# EAGLE design 2_10decoder (EAGLE 8.7.0)
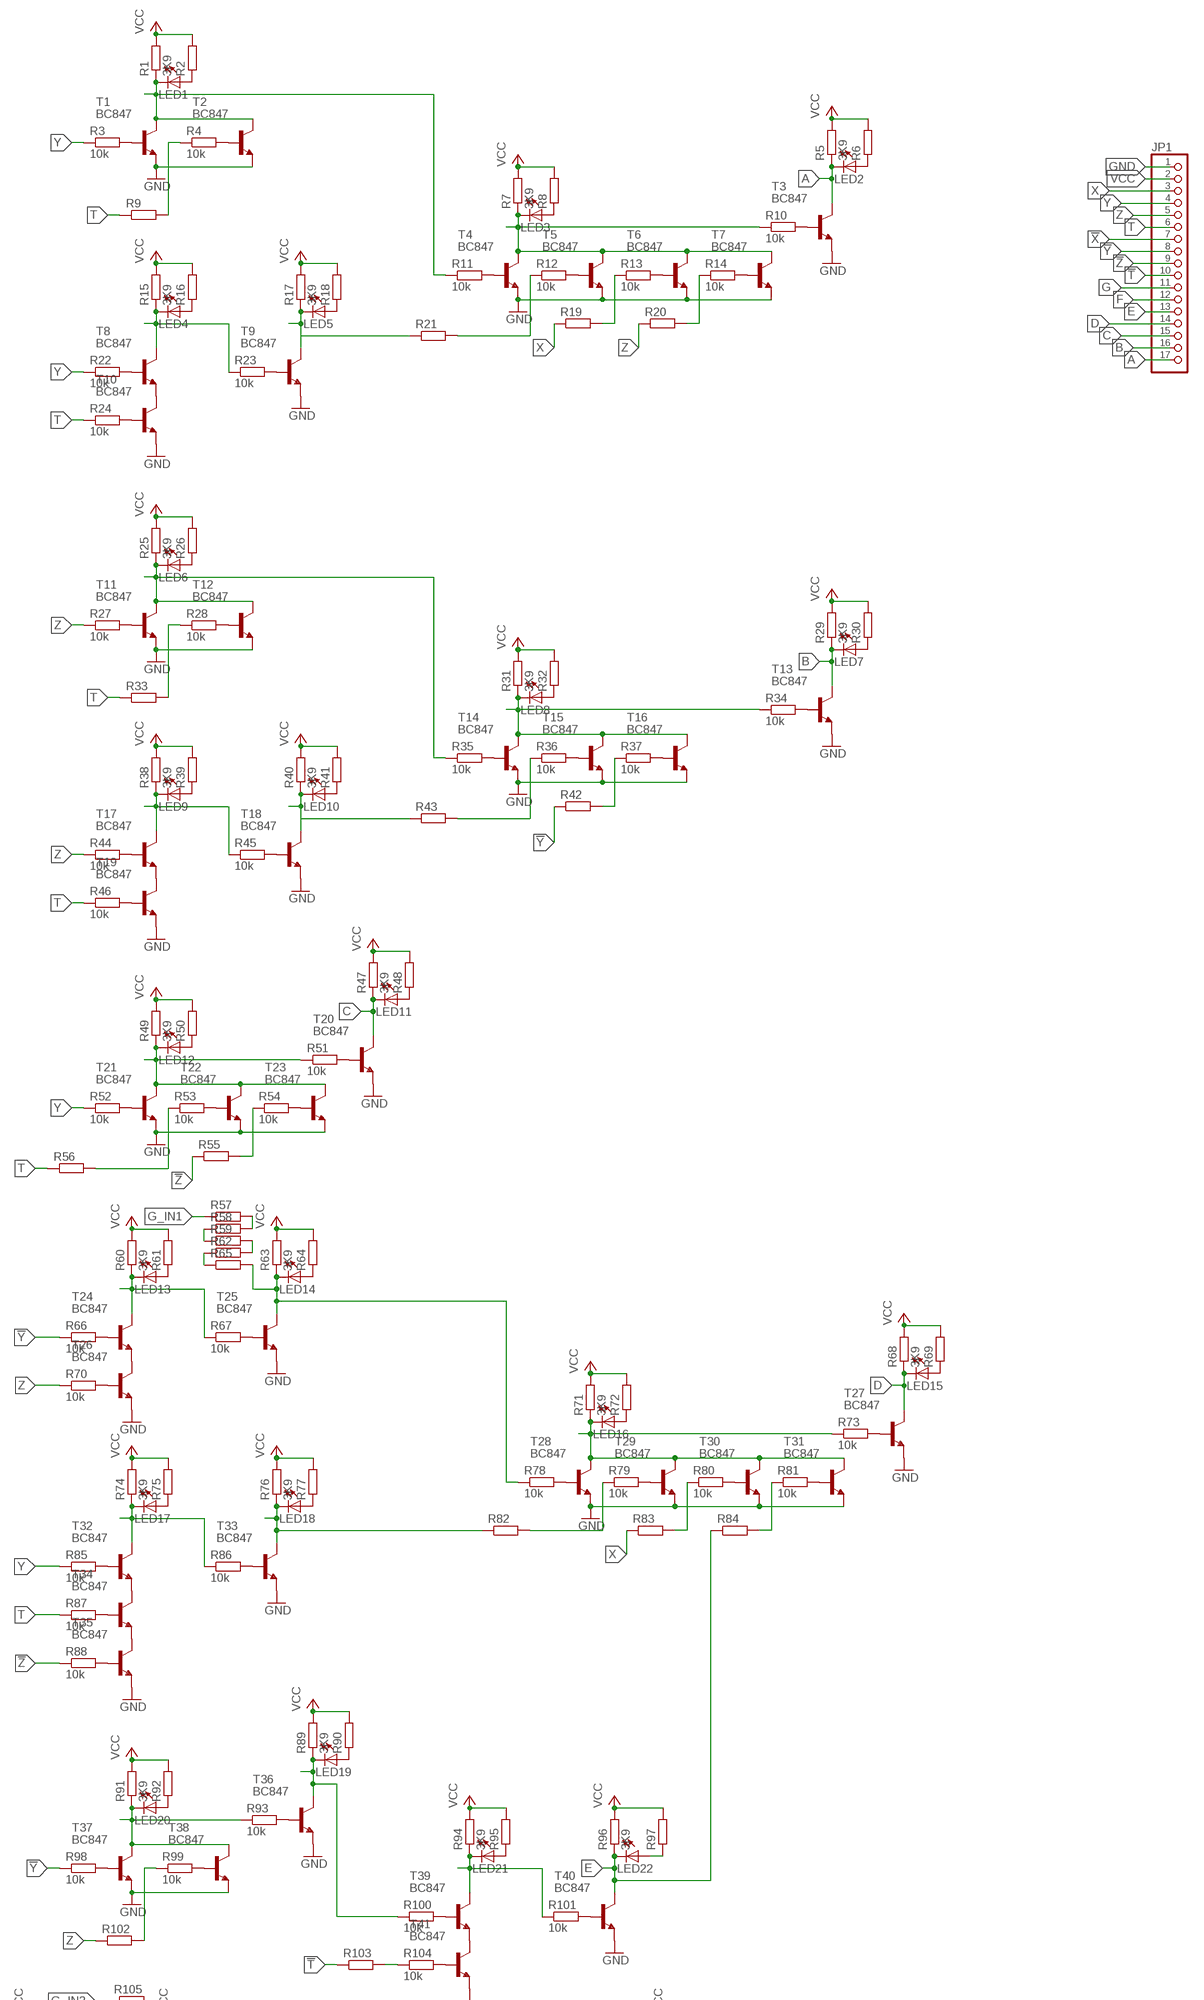
[diagram p0: schematic, sheet 1, part 1 of 2]
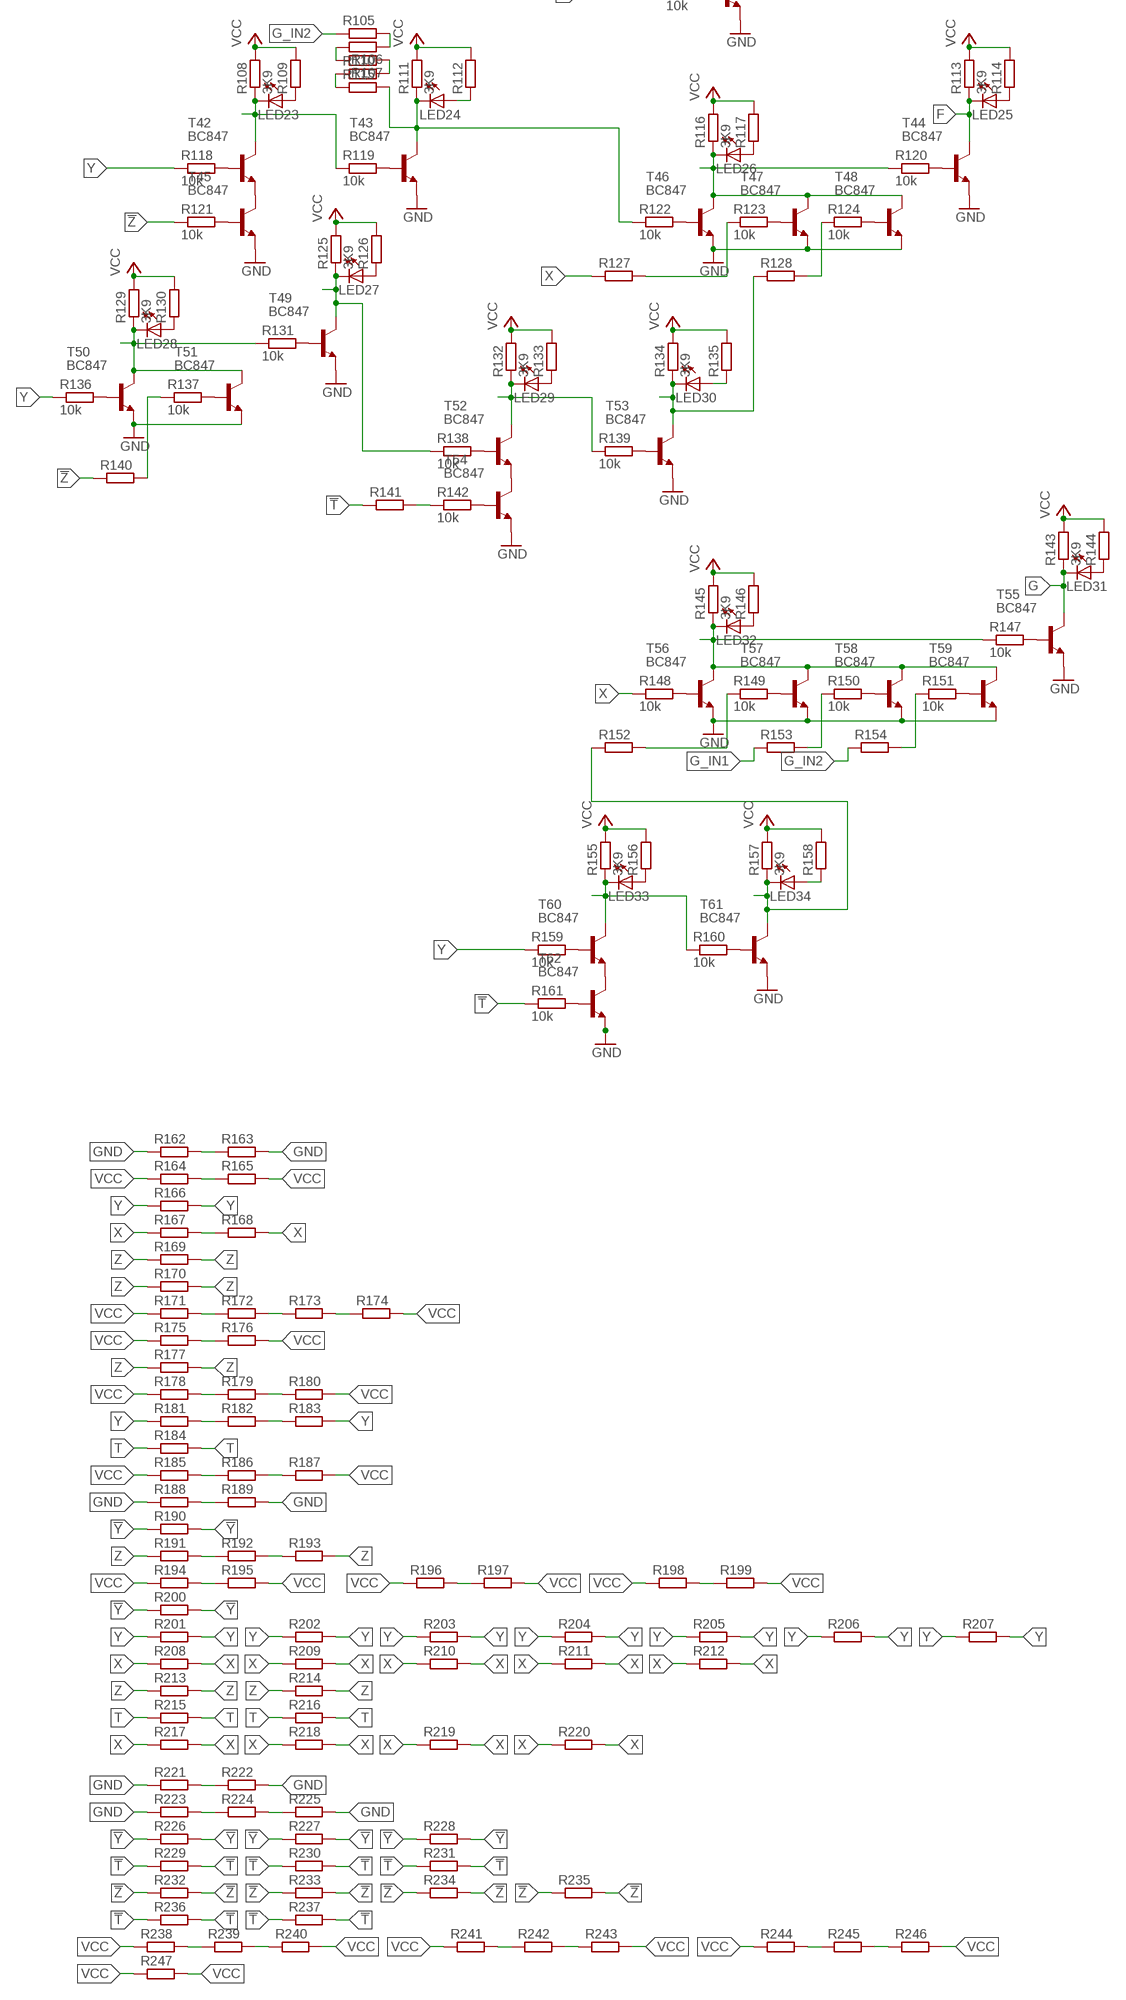
[diagram p1: schematic, sheet 1, part 2 of 2]

## Parts
JP1  PINHD-1X17_2.54-SMD-90°  [1X17SMD/90]
LED1  LEDCHIP-LED0805  [CHIP-LED0805]
LED2  LEDCHIP-LED0805  [CHIP-LED0805]
LED3  LEDCHIP-LED0805  [CHIP-LED0805]
LED4  LEDCHIP-LED0805  [CHIP-LED0805]
LED5  LEDCHIP-LED0805  [CHIP-LED0805]
LED6  LEDCHIP-LED0805  [CHIP-LED0805]
LED7  LEDCHIP-LED0805  [CHIP-LED0805]
LED8  LEDCHIP-LED0805  [CHIP-LED0805]
LED9  LEDCHIP-LED0805  [CHIP-LED0805]
LED10  LEDCHIP-LED0805  [CHIP-LED0805]
LED11  LEDCHIP-LED0805  [CHIP-LED0805]
LED12  LEDCHIP-LED0805  [CHIP-LED0805]
LED13  LEDCHIP-LED0805  [CHIP-LED0805]
LED14  LEDCHIP-LED0805  [CHIP-LED0805]
LED15  LEDCHIP-LED0805  [CHIP-LED0805]
LED16  LEDCHIP-LED0805  [CHIP-LED0805]
LED17  LEDCHIP-LED0805  [CHIP-LED0805]
LED18  LEDCHIP-LED0805  [CHIP-LED0805]
LED19  LEDCHIP-LED0805  [CHIP-LED0805]
LED20  LEDCHIP-LED0805  [CHIP-LED0805]
LED21  LEDCHIP-LED0805  [CHIP-LED0805]
LED22  LEDCHIP-LED0805  [CHIP-LED0805]
LED23  LEDCHIP-LED0805  [CHIP-LED0805]
LED24  LEDCHIP-LED0805  [CHIP-LED0805]
LED25  LEDCHIP-LED0805  [CHIP-LED0805]
LED26  LEDCHIP-LED0805  [CHIP-LED0805]
LED27  LEDCHIP-LED0805  [CHIP-LED0805]
LED28  LEDCHIP-LED0805  [CHIP-LED0805]
LED29  LEDCHIP-LED0805  [CHIP-LED0805]
LED30  LEDCHIP-LED0805  [CHIP-LED0805]
LED31  LEDCHIP-LED0805  [CHIP-LED0805]
LED32  LEDCHIP-LED0805  [CHIP-LED0805]
LED33  LEDCHIP-LED0805  [CHIP-LED0805]
LED34  LEDCHIP-LED0805  [CHIP-LED0805]
R1  3K9  R-EU_M0805  [M0805]
R2  R-EU_M0805  [M0805]
R3  10k  R-EU_M0805  [M0805]
R4  10k  R-EU_M0805  [M0805]
R5  3K9  R-EU_M0805  [M0805]
R6  R-EU_M0805  [M0805]
R7  3K9  R-EU_M0805  [M0805]
R8  R-EU_M0805  [M0805]
R9  R-EU_M1206  [M1206]
R10  10k  R-EU_M0805  [M0805]
R11  10k  R-EU_M0805  [M0805]
R12  10k  R-EU_M0805  [M0805]
R13  10k  R-EU_M0805  [M0805]
R14  10k  R-EU_M0805  [M0805]
R15  3K9  R-EU_M0805  [M0805]
R16  R-EU_M0805  [M0805]
R17  3K9  R-EU_M0805  [M0805]
R18  R-EU_M0805  [M0805]
R19  R-EU_M1206  [M1206]
R20  R-EU_M1206  [M1206]
R21  R-EU_M1206  [M1206]
R22  10k  R-EU_M0805  [M0805]
R23  10k  R-EU_M0805  [M0805]
R24  10k  R-EU_M0805  [M0805]
R25  3K9  R-EU_M0805  [M0805]
R26  R-EU_M0805  [M0805]
R27  10k  R-EU_M0805  [M0805]
R28  10k  R-EU_M0805  [M0805]
R29  3K9  R-EU_M0805  [M0805]
R30  R-EU_M0805  [M0805]
R31  3K9  R-EU_M0805  [M0805]
R32  R-EU_M0805  [M0805]
R33  R-EU_M1206  [M1206]
R34  10k  R-EU_M0805  [M0805]
R35  10k  R-EU_M0805  [M0805]
R36  10k  R-EU_M0805  [M0805]
R37  10k  R-EU_M0805  [M0805]
R38  3K9  R-EU_M0805  [M0805]
R39  R-EU_M0805  [M0805]
R40  3K9  R-EU_M0805  [M0805]
R41  R-EU_M0805  [M0805]
R42  R-EU_M1206  [M1206]
R43  R-EU_M1206  [M1206]
R44  10k  R-EU_M0805  [M0805]
R45  10k  R-EU_M0805  [M0805]
R46  10k  R-EU_M0805  [M0805]
R47  3K9  R-EU_M0805  [M0805]
R48  R-EU_M0805  [M0805]
R49  3K9  R-EU_M0805  [M0805]
R50  R-EU_M0805  [M0805]
R51  10k  R-EU_M0805  [M0805]
R52  10k  R-EU_M0805  [M0805]
R53  10k  R-EU_M0805  [M0805]
R54  10k  R-EU_M0805  [M0805]
R55  R-EU_M1206  [M1206]
R56  R-EU_M1206  [M1206]
R57  R-EU_M1206  [M1206]
R58  R-EU_M1206  [M1206]
R59  R-EU_M1206  [M1206]
R60  3K9  R-EU_M0805  [M0805]
R61  R-EU_M0805  [M0805]
R62  R-EU_M1206  [M1206]
R63  3K9  R-EU_M0805  [M0805]
R64  R-EU_M0805  [M0805]
R65  R-EU_M1206  [M1206]
R66  10k  R-EU_M0805  [M0805]
R67  10k  R-EU_M0805  [M0805]
R68  3K9  R-EU_M0805  [M0805]
R69  R-EU_M0805  [M0805]
R70  10k  R-EU_M0805  [M0805]
R71  3K9  R-EU_M0805  [M0805]
R72  R-EU_M0805  [M0805]
R73  10k  R-EU_M0805  [M0805]
R74  3K9  R-EU_M0805  [M0805]
R75  R-EU_M0805  [M0805]
R76  3K9  R-EU_M0805  [M0805]
R77  R-EU_M0805  [M0805]
R78  10k  R-EU_M0805  [M0805]
R79  10k  R-EU_M0805  [M0805]
R80  10k  R-EU_M0805  [M0805]
R81  10k  R-EU_M0805  [M0805]
R82  R-EU_M1206  [M1206]
R83  R-EU_M1206  [M1206]
R84  R-EU_M1206  [M1206]
R85  10k  R-EU_M0805  [M0805]
R86  10k  R-EU_M0805  [M0805]
R87  10k  R-EU_M0805  [M0805]
R88  10k  R-EU_M0805  [M0805]
R89  3K9  R-EU_M0805  [M0805]
R90  R-EU_M0805  [M0805]
R91  3K9  R-EU_M0805  [M0805]
R92  R-EU_M0805  [M0805]
R93  10k  R-EU_M0805  [M0805]
R94  3K9  R-EU_M0805  [M0805]
R95  R-EU_M0805  [M0805]
R96  3K9  R-EU_M0805  [M0805]
R97  R-EU_M0805  [M0805]
R98  10k  R-EU_M0805  [M0805]
R99  10k  R-EU_M0805  [M0805]
R100  10k  R-EU_M0805  [M0805]
R101  10k  R-EU_M0805  [M0805]
R102  R-EU_M1206  [M1206]
R103  R-EU_M1206  [M1206]
R104  10k  R-EU_M0805  [M0805]
R105  R-EU_M1206  [M1206]
R106  R-EU_M1206  [M1206]
R107  R-EU_M1206  [M1206]
R108  3K9  R-EU_M0805  [M0805]
R109  R-EU_M0805  [M0805]
R110  R-EU_M1206  [M1206]
R111  3K9  R-EU_M0805  [M0805]
R112  R-EU_M0805  [M0805]
R113  3K9  R-EU_M0805  [M0805]
R114  R-EU_M0805  [M0805]
R115  R-EU_M1206  [M1206]
R116  3K9  R-EU_M0805  [M0805]
R117  R-EU_M0805  [M0805]
R118  10k  R-EU_M0805  [M0805]
R119  10k  R-EU_M0805  [M0805]
R120  10k  R-EU_M0805  [M0805]
R121  10k  R-EU_M0805  [M0805]
R122  10k  R-EU_M0805  [M0805]
R123  10k  R-EU_M0805  [M0805]
R124  10k  R-EU_M0805  [M0805]
R125  3K9  R-EU_M0805  [M0805]
R126  R-EU_M0805  [M0805]
R127  R-EU_M1206  [M1206]
R128  R-EU_M1206  [M1206]
R129  3K9  R-EU_M0805  [M0805]
R130  R-EU_M0805  [M0805]
R131  10k  R-EU_M0805  [M0805]
R132  3K9  R-EU_M0805  [M0805]
R133  R-EU_M0805  [M0805]
R134  3K9  R-EU_M0805  [M0805]
R135  R-EU_M0805  [M0805]
R136  10k  R-EU_M0805  [M0805]
R137  10k  R-EU_M0805  [M0805]
R138  10k  R-EU_M0805  [M0805]
R139  10k  R-EU_M0805  [M0805]
R140  R-EU_M1206  [M1206]
R141  R-EU_M1206  [M1206]
R142  10k  R-EU_M0805  [M0805]
R143  3K9  R-EU_M0805  [M0805]
R144  R-EU_M0805  [M0805]
R145  3K9  R-EU_M0805  [M0805]
R146  R-EU_M0805  [M0805]
R147  10k  R-EU_M0805  [M0805]
R148  10k  R-EU_M0805  [M0805]
R149  10k  R-EU_M0805  [M0805]
R150  10k  R-EU_M0805  [M0805]
R151  10k  R-EU_M0805  [M0805]
R152  R-EU_M1206  [M1206]
R153  R-EU_M1206  [M1206]
R154  R-EU_M1206  [M1206]
R155  3K9  R-EU_M0805  [M0805]
R156  R-EU_M0805  [M0805]
R157  3K9  R-EU_M0805  [M0805]
R158  R-EU_M0805  [M0805]
R159  10k  R-EU_M0805  [M0805]
R160  10k  R-EU_M0805  [M0805]
R161  10k  R-EU_M0805  [M0805]
R162  R-EU_M1206  [M1206]
R163  R-EU_M1206  [M1206]
R164  R-EU_M1206  [M1206]
R165  R-EU_M1206  [M1206]
R166  R-EU_M1206  [M1206]
R167  R-EU_M1206  [M1206]
R168  R-EU_M1206  [M1206]
R169  R-EU_M1206  [M1206]
R170  R-EU_M1206  [M1206]
R171  R-EU_M1206  [M1206]
R172  R-EU_M1206  [M1206]
R173  R-EU_M1206  [M1206]
R174  R-EU_M1206  [M1206]
R175  R-EU_M1206  [M1206]
R176  R-EU_M1206  [M1206]
R177  R-EU_M1206  [M1206]
R178  R-EU_M1206  [M1206]
R179  R-EU_M1206  [M1206]
R180  R-EU_M1206  [M1206]
R181  R-EU_M1206  [M1206]
R182  R-EU_M1206  [M1206]
R183  R-EU_M1206  [M1206]
R184  R-EU_M1206  [M1206]
R185  R-EU_M1206  [M1206]
R186  R-EU_M1206  [M1206]
R187  R-EU_M1206  [M1206]
R188  R-EU_M1206  [M1206]
R189  R-EU_M1206  [M1206]
R190  R-EU_M1206  [M1206]
R191  R-EU_M1206  [M1206]
R192  R-EU_M1206  [M1206]
R193  R-EU_M1206  [M1206]
R194  R-EU_M1206  [M1206]
R195  R-EU_M1206  [M1206]
R196  R-EU_M1206  [M1206]
R197  R-EU_M1206  [M1206]
R198  R-EU_M1206  [M1206]
R199  R-EU_M1206  [M1206]
R200  R-EU_M1206  [M1206]
R201  R-EU_M1206  [M1206]
R202  R-EU_M1206  [M1206]
R203  R-EU_M1206  [M1206]
R204  R-EU_M1206  [M1206]
R205  R-EU_M1206  [M1206]
R206  R-EU_M1206  [M1206]
R207  R-EU_M1206  [M1206]
R208  R-EU_M1206  [M1206]
R209  R-EU_M1206  [M1206]
R210  R-EU_M1206  [M1206]
R211  R-EU_M1206  [M1206]
R212  R-EU_M1206  [M1206]
R213  R-EU_M1206  [M1206]
R214  R-EU_M1206  [M1206]
R215  R-EU_M1206  [M1206]
R216  R-EU_M1206  [M1206]
R217  R-EU_M1206  [M1206]
R218  R-EU_M1206  [M1206]
R219  R-EU_M1206  [M1206]
R220  R-EU_M1206  [M1206]
R221  R-EU_M1206  [M1206]
R222  R-EU_M1206  [M1206]
R223  R-EU_M1206  [M1206]
R224  R-EU_M1206  [M1206]
R225  R-EU_M1206  [M1206]
R226  R-EU_M1206  [M1206]
R227  R-EU_M1206  [M1206]
R228  R-EU_M1206  [M1206]
R229  R-EU_M1206  [M1206]
R230  R-EU_M1206  [M1206]
R231  R-EU_M1206  [M1206]
R232  R-EU_M1206  [M1206]
R233  R-EU_M1206  [M1206]
R234  R-EU_M1206  [M1206]
R235  R-EU_M1206  [M1206]
R236  R-EU_M1206  [M1206]
R237  R-EU_M1206  [M1206]
R238  R-EU_M1206  [M1206]
R239  R-EU_M1206  [M1206]
R240  R-EU_M1206  [M1206]
R241  R-EU_M1206  [M1206]
R242  R-EU_M1206  [M1206]
R243  R-EU_M1206  [M1206]
R244  R-EU_M1206  [M1206]
R245  R-EU_M1206  [M1206]
R246  R-EU_M1206  [M1206]
R247  R-EU_M1206  [M1206]
T1  BC847  [SOT23]
T2  BC847  [SOT23]
T3  BC847  [SOT23]
T4  BC847  [SOT23]
T5  BC847  [SOT23]
T6  BC847  [SOT23]
T7  BC847  [SOT23]
T8  BC847  [SOT23]
T9  BC847  [SOT23]
T10  BC847  [SOT23]
T11  BC847  [SOT23]
T12  BC847  [SOT23]
T13  BC847  [SOT23]
T14  BC847  [SOT23]
T15  BC847  [SOT23]
T16  BC847  [SOT23]
T17  BC847  [SOT23]
T18  BC847  [SOT23]
T19  BC847  [SOT23]
T20  BC847  [SOT23]
T21  BC847  [SOT23]
T22  BC847  [SOT23]
T23  BC847  [SOT23]
T24  BC847  [SOT23]
T25  BC847  [SOT23]
T26  BC847  [SOT23]
T27  BC847  [SOT23]
T28  BC847  [SOT23]
T29  BC847  [SOT23]
T30  BC847  [SOT23]
T31  BC847  [SOT23]
T32  BC847  [SOT23]
T33  BC847  [SOT23]
T34  BC847  [SOT23]
T35  BC847  [SOT23]
T36  BC847  [SOT23]
T37  BC847  [SOT23]
T38  BC847  [SOT23]
T39  BC847  [SOT23]
T40  BC847  [SOT23]
T41  BC847  [SOT23]
T42  BC847  [SOT23]
T43  BC847  [SOT23]
T44  BC847  [SOT23]
T45  BC847  [SOT23]
T46  BC847  [SOT23]
T47  BC847  [SOT23]
T48  BC847  [SOT23]
T49  BC847  [SOT23]
T50  BC847  [SOT23]
T51  BC847  [SOT23]
T52  BC847  [SOT23]
T53  BC847  [SOT23]
T54  BC847  [SOT23]
T55  BC847  [SOT23]
T56  BC847  [SOT23]
T57  BC847  [SOT23]
T58  BC847  [SOT23]
T59  BC847  [SOT23]
T60  BC847  [SOT23]
T61  BC847  [SOT23]
T62  BC847  [SOT23]

## Nets
!T: JP1.10 R103.1 R141.1 R161.1 R229.1 R229.2 R230.1 R230.2 R231.1 R231.2 R236.1 R236.2 R237.1 R237.2
!X: JP1.7
!Y: JP1.8 R42.1 R66.1 R98.1 R190.1 R190.2 R200.1 R200.2 R226.1 R226.2 R227.1 R227.2 R228.1 R228.2
!Z: JP1.9 R55.1 R88.1 R121.1 R140.1 R232.1 R232.2 R233.1 R233.2 R234.1 R234.2 R235.1 R235.2
A: JP1.17 LED2.C R5.1 T3.3(C)
B: JP1.16 LED7.C R29.1 T13.3(C)
C: JP1.15 LED11.C R47.1 T20.3(C)
D: JP1.14 LED15.C R68.1 T27.3(C)
E: JP1.13 LED22.C R84.1 R96.1 T40.3(C)
F: JP1.12 LED25.C R113.1 T44.3(C)
G: JP1.11 LED31.C R143.1 T55.3(C)
G_IN1: R57.1 R153.1
G_IN2: R105.1 R154.1
GND: JP1.1 R162.1 R163.2 R188.1 R188.2 R189.1 R189.2 R221.1 R221.2 R222.1 R222.2 R223.1 R223.2 R224.1 R224.2 R225.1 R225.2 T1.2(E) T2.2(E) T3.2(E) T4.2(E) T5.2(E) T6.2(E) T7.2(E) T9.2(E) T10.2(E) T11.2(E) T12.2(E) T13.2(E) T14.2(E) T15.2(E) T16.2(E) T18.2(E) T19.2(E) T20.2(E) T21.2(E) T22.2(E) T23.2(E) T25.2(E) T26.2(E) T27.2(E) T28.2(E) T29.2(E) T30.2(E) T31.2(E) T33.2(E) T35.2(E) T36.2(E) T37.2(E) T38.2(E) T40.2(E) T41.2(E) T43.2(E) T44.2(E) T45.2(E) T46.2(E) T47.2(E) T48.2(E) T49.2(E) T50.2(E) T51.2(E) T53.2(E) T54.2(E) T55.2(E) T56.2(E) T57.2(E) T58.2(E) T59.2(E) T61.2(E) T62.2(E)
N$1: LED4.A R16.1
N$2: LED4.C R15.1 R23.1 T8.3(C)
N$3: R3.2 T1.1(B)
N$4: R4.2 T2.1(B)
N$5: R22.2 T8.1(B)
N$6: R23.2 T9.1(B)
N$7: R24.2 T10.1(B)
N$8: R11.2 T4.1(B)
N$9: R10.2 T3.1(B)
N$10: R12.2 T5.1(B)
N$11: R13.2 T6.1(B)
N$12: R14.2 T7.1(B)
N$13: LED1.A R2.1
N$14: LED1.C R1.1 R11.1 T1.3(C) T2.3(C)
N$15: R4.1 R9.2
N$16: R103.2 R104.1
N$17: LED3.A R8.1
N$18: LED3.C R7.1 R10.1 T4.3(C) T5.3(C) T6.3(C) T7.3(C)
N$19: LED5.A R18.1
N$20: LED5.C R17.1 R21.1 T9.3(C)
N$21: LED2.A R6.1
N$22: R141.2 R142.1
N$23: T8.2(E) T10.3(C)
N$24: R12.1 R21.2
N$25: R106.2 R107.2
N$26: R110.1 R115.1
N$27: R27.2 T11.1(B)
N$28: R28.2 T12.1(B)
N$29: R13.1 R19.2
N$30: R14.1 R20.2
N$31: R44.2 T17.1(B)
N$32: R45.2 T18.1(B)
N$33: R46.2 T19.1(B)
N$34: R35.2 T14.1(B)
N$35: R34.2 T13.1(B)
N$36: R36.2 T15.1(B)
N$37: R37.2 T16.1(B)
N$38: R105.2 R106.1
N$39: LED6.A R26.1
N$40: LED6.C R25.1 R35.1 T11.3(C) T12.3(C)
N$41: R28.1 R33.2
N$42: R107.1 R110.2
N$43: LED9.A R39.1
N$44: LED9.C R38.1 R45.1 T17.3(C)
N$45: LED8.A R32.1
N$46: LED8.C R31.1 R34.1 T14.3(C) T15.3(C) T16.3(C)
N$47: LED10.A R41.1
N$48: LED10.C R40.1 R43.1 T18.3(C)
N$49: LED7.A R30.1
N$50: R62.1 R65.1
N$51: T17.2(E) T19.3(C)
N$52: R59.2 R62.2
N$53: R58.1 R59.1
N$54: R37.1 R42.2
N$55: R57.2 R58.2
N$56: R36.1 R43.2
N$57: R52.2 T21.1(B)
N$58: R51.2 T20.1(B)
N$59: R53.2 T22.1(B)
N$60: R54.2 T23.1(B)
N$61: R78.2 T28.1(B)
N$62: R73.2 T27.1(B)
N$63: LED12.A R50.1
N$64: LED12.C R49.1 R51.1 T21.3(C) T22.3(C) T23.3(C)
N$65: R79.2 T29.1(B)
N$66: LED11.A R48.1
N$67: R162.2 R163.1
N$68: R54.1 R55.2
N$69: R80.2 T30.1(B)
N$70: R53.1 R56.2
N$71: R81.2 T31.1(B)
N$72: R164.2 R165.1
N$73: LED16.A R72.1
N$74: LED16.C R71.1 R73.1 T28.3(C) T29.3(C) T30.3(C) T31.3(C)
N$75: R85.2 T32.1(B)
N$76: LED15.A R69.1
N$77: R167.2 R168.1
N$78: R80.1 R83.2
N$79: R81.1 R84.2
N$80: R79.1 R82.2
N$81: T34.2(E) T35.3(C)
N$82: R67.2 T25.1(B)
N$83: R70.2 T26.1(B)
N$84: LED13.A R61.1
N$85: LED13.C R60.1 R67.1 T24.3(C)
N$86: LED14.A R64.1
N$87: R86.2 T33.1(B)
N$88: T24.2(E) T26.3(C)
N$89: R122.2 T46.1(B)
N$90: R171.2 R172.1
N$91: R87.2 T34.1(B)
N$92: LED17.A R75.1
N$93: R123.2 T47.1(B)
N$94: LED18.A R77.1
N$95: T32.2(E) T34.3(C)
N$96: R159.2 T60.1(B)
N$97: R173.2 R174.1
N$98: LED18.C R76.1 R82.1 T33.3(C)
N$99: R88.2 T35.1(B)
N$100: LED26.A R117.1
N$101: R98.2 T37.1(B)
N$102: R99.2 T38.1(B)
N$103: LED20.A R92.1
N$104: LED20.C R91.1 R93.1 T37.3(C) T38.3(C)
N$105: LED26.C R116.1 R120.1 T46.3(C) T47.3(C) T48.3(C)
N$106: LED25.A R114.1
N$107: R93.2 T36.1(B)
N$108: R100.2 T39.1(B)
N$109: LED19.A R90.1
N$110: R175.2 R176.1
N$111: R101.2 T40.1(B)
N$112: R178.2 R179.1
N$113: R181.2 R182.1
N$114: R124.1 R128.2
N$115: R123.1 R127.2
N$116: R185.2 R186.1
N$117: R191.2 R192.1
N$118: R121.2 T45.1(B)
N$119: LED17.C R74.1 R86.1 T32.3(C)
N$120: R194.2 R195.1
N$121: LED23.A R109.1
N$122: R196.2 R197.1
N$123: R198.2 R199.1
N$124: R238.2 R239.1
N$125: T42.2(E) T45.3(C)
N$126: R241.2 R242.1
N$127: R104.2 T41.1(B)
N$128: R244.2 R245.1
N$129: LED21.C R94.1 R101.1 T39.3(C)
N$132: R136.2 T50.1(B)
N$139: R99.1 R102.2
N$141: R131.2 T49.1(B)
N$143: R138.2 T52.1(B)
N$144: LED19.C R89.1 R100.1 T36.3(C)
N$145: T39.2(E) T41.3(C)
N$147: LED21.A R95.1
N$148: R139.2 T53.1(B)
N$151: LED29.C R132.1 R139.1 T52.3(C)
N$152: T52.2(E) T54.3(C)
N$153: LED27.C R125.1 R138.1 T49.3(C)
N$157: R147.2 T55.1(B)
N$158: R149.2 T57.1(B)
N$159: R150.2 T58.1(B)
N$160: R151.2 T59.1(B)
N$162: R150.1 R153.2
N$164: R149.1 R152.2
N$166: R151.1 R154.2
N$168: R160.2 T61.1(B)
N$169: R161.2 T62.1(B)
N$173: T60.2(E) T62.3(C)
N$200: R66.2 T24.1(B)
N$251: LED28.A R130.1
N$252: LED28.C R129.1 R131.1 T50.3(C) T51.3(C)
N$253: LED27.A R126.1
N$254: LED29.A R133.1
N$255: LED30.C R128.1 R134.1 T53.3(C)
N$256: LED32.A R146.1
N$257: LED32.C R145.1 R147.1 T56.3(C) T57.3(C) T58.3(C) T59.3(C)
N$258: LED31.A R144.1
N$260: LED33.A R156.1
N$261: LED33.C R155.1 R160.1 T60.3(C)
N$262: LED34.C R152.1 R157.1 T61.3(C)
N$263: R120.2 T44.1(B)
N$264: R118.2 T42.1(B)
N$265: R124.2 T48.1(B)
N$266: LED23.C R108.1 R119.1 T42.3(C)
N$267: R119.2 T43.1(B)
N$269: R148.2 T56.1(B)
N$271: R137.1 R140.2
N$272: R137.2 T51.1(B)
N$274: R142.2 T54.1(B)
S$2: LED22.A R97.1
S$4: LED24.A R112.1
S$5: LED34.A R158.1
S$40: LED30.A R135.1
S$123: LED24.C R111.1 R115.2 R122.1 T43.3(C)
S$124: LED14.C R63.1 R65.2 R78.1 T25.3(C)
T: JP1.6 R9.1 R24.1 R33.1 R46.1 R56.1 R87.1 R184.1 R184.2 R215.1 R215.2 R216.1 R216.2
VCC: JP1.2 R1.2 R2.2 R5.2 R6.2 R7.2 R8.2 R15.2 R16.2 R17.2 R18.2 R25.2 R26.2 R29.2 R30.2 R31.2 R32.2 R38.2 R39.2 R40.2 R41.2 R47.2 R48.2 R49.2 R50.2 R60.2 R61.2 R63.2 R64.2 R68.2 R69.2 R71.2 R72.2 R74.2 R75.2 R76.2 R77.2 R89.2 R90.2 R91.2 R92.2 R94.2 R95.2 R96.2 R97.2 R108.2 R109.2 R111.2 R112.2 R113.2 R114.2 R116.2 R117.2 R125.2 R126.2 R129.2 R130.2 R132.2 R133.2 R134.2 R135.2 R143.2 R144.2 R145.2 R146.2 R155.2 R156.2 R157.2 R158.2 R164.1 R165.2 R171.1 R172.2 R173.1 R174.2 R175.1 R176.2 R178.1 R179.2 R180.1 R180.2 R182.2 R183.1 R185.1 R186.2 R187.1 R187.2 R194.1 R195.2 R196.1 R197.2 R198.1 R199.2 R238.1 R239.2 R240.1 R240.2 R241.1 R242.2 R243.1 R243.2 R244.1 R245.2 R246.1 R246.2 R247.1 R247.2
X: JP1.3 R19.1 R83.1 R127.1 R148.1 R167.1 R168.2 R208.1 R208.2 R209.1 R209.2 R210.1 R210.2 R211.1 R211.2 R212.1 R212.2 R217.1 R217.2 R218.1 R218.2 R219.1 R219.2 R220.1 R220.2
Y: JP1.4 R3.1 R22.1 R52.1 R85.1 R118.1 R136.1 R159.1 R166.1 R166.2 R181.1 R183.2 R201.1 R201.2 R202.1 R202.2 R203.1 R203.2 R204.1 R204.2 R205.1 R205.2 R206.1 R206.2 R207.1 R207.2
Z: JP1.5 R20.1 R27.1 R44.1 R70.1 R102.1 R169.1 R169.2 R170.1 R170.2 R177.1 R177.2 R191.1 R192.2 R193.1 R193.2 R213.1 R213.2 R214.1 R214.2

## Library data of the parts
JP1 = pinhead-2:PINHD-1X17: PIN HEADER
LED1-LED34 = led:LED: LED OSRAM: - CHIPLED LG R971, LG N971, LY N971, LG Q971, LY Q971, LO R971, LY R971 LH N974, LH R974 LS Q976, LO Q976, LY Q976 LO Q996 - Hyper CHIPLED LW Q18S LB Q993, LB Q99A, LB R99A - SideLED LS A670, LO A670, LY A670, LG A670, LP A670 LB A673, LV A673, LT A673, LW A673 LH A674 LY A675 LS A676, LA A676, LO A676, LY A676, LW A676 LS A679, LY A679, LG A679 - Hyper Micro SIDELED® LS Y876, LA Y876, LO Y876, LY Y876 LT Y87S - SmartLED LW L88C, LW L88S LB L89C, LB L89S, LG L890 LS L89K, LO L89K, LY L89K LS L896, LA L896, LO L896, LY L896 - TOPLED LS T670, LO T670, LY T670, LG T670, LP T670 LSG T670, LSP T670, LSY T670, LOP T670, LYG T670 LG T671, LOG T671, LSG T671 LB T673, LV T673, LT T673, LW T673 LH T674 LS T676, LA T676, LO T676, LY T676, LB T676, LH T676, LSB T676, LW T676 LB T67C, LV T67C, LT T67C, LS T67K, LO T67K, LY T67K, LW E67C LS E67B, LA E67B, LO E67B, LY E67B, LB E67C, LV E67C, LT E67C LW T67C LS T679, LY T679, LG T679 LS T770, LO T770, LY T770, LG T770, LP T770 LB T773, LV T773, LT T773, LW T773 LH T774 LS E675, LA E675, LY E675, LS T675 LS T776, LA T776, LO T776, LY T776, LB T776 LHGB T686 LT T68C, LB T68C - Hyper Mini TOPLED® LB M676 - Mini TOPLED Santana® LG M470 LS M47K, LO M47K, LY M47K Source: http://www.osram.convergy.de LUXEON: - LUMILED® LXK2-PW12-R00, LXK2-PW12-S00, LXK2-PW14-U00, LXK2-PW14-V00 LXK2-PM12-R00, LXK2-PM12-S00, LXK2-PM14-U00 LXK2-PE12-Q00, LXK2-PE12-R00, LXK2-PE12-S00, LXK2-PE14-T00, LXK2-PE14-U00 LXK2-PB12-K00, LXK2-PB12-L00, LXK2-PB12-M00, LXK2-PB14-N00, LXK2-PB14-P00, LXK2-PB14-Q00 LXK2-PR12-L00, LXK2-PR12-M00, LXK2-PR14-Q00, LXK2-PR14-R00 LXK2-PD12-Q00, LXK2-PD12-R00, LXK2-PD12-S00 LXK2-PH12-R00, LXK2-PH12-S00 LXK2-PL12-P00, LXK2-PL12-Q00, LXK2-PL12-R00 Source: www.luxeon.com KINGBRIGHT: KA-3528ASYC Source: www.kingbright.com
R1-R8 R10-R18 R22-R32 R34-R41 R44-R54 R60 R61 R63 R64 R66-R81 R85-R101 R104 R108 R109 R111-R114 R116-R126 R129-R139 R142-R151 R155-R161 = resistor:R-EU_: RESISTOR, European symbol
R9 R19-R21 R33 R42 R43 R55-R59 R62 R65 R82-R84 R102 R103 R105-R107 R110 R115 R127 R128 R140 R141 R152-R154 R162-R247 = rcl:R-EU_: RESISTOR, European symbol; SPICEPREFIX: R
T1-T62 = transistor-neu-to92:BC847: NPN TRANSISTOR

## Board
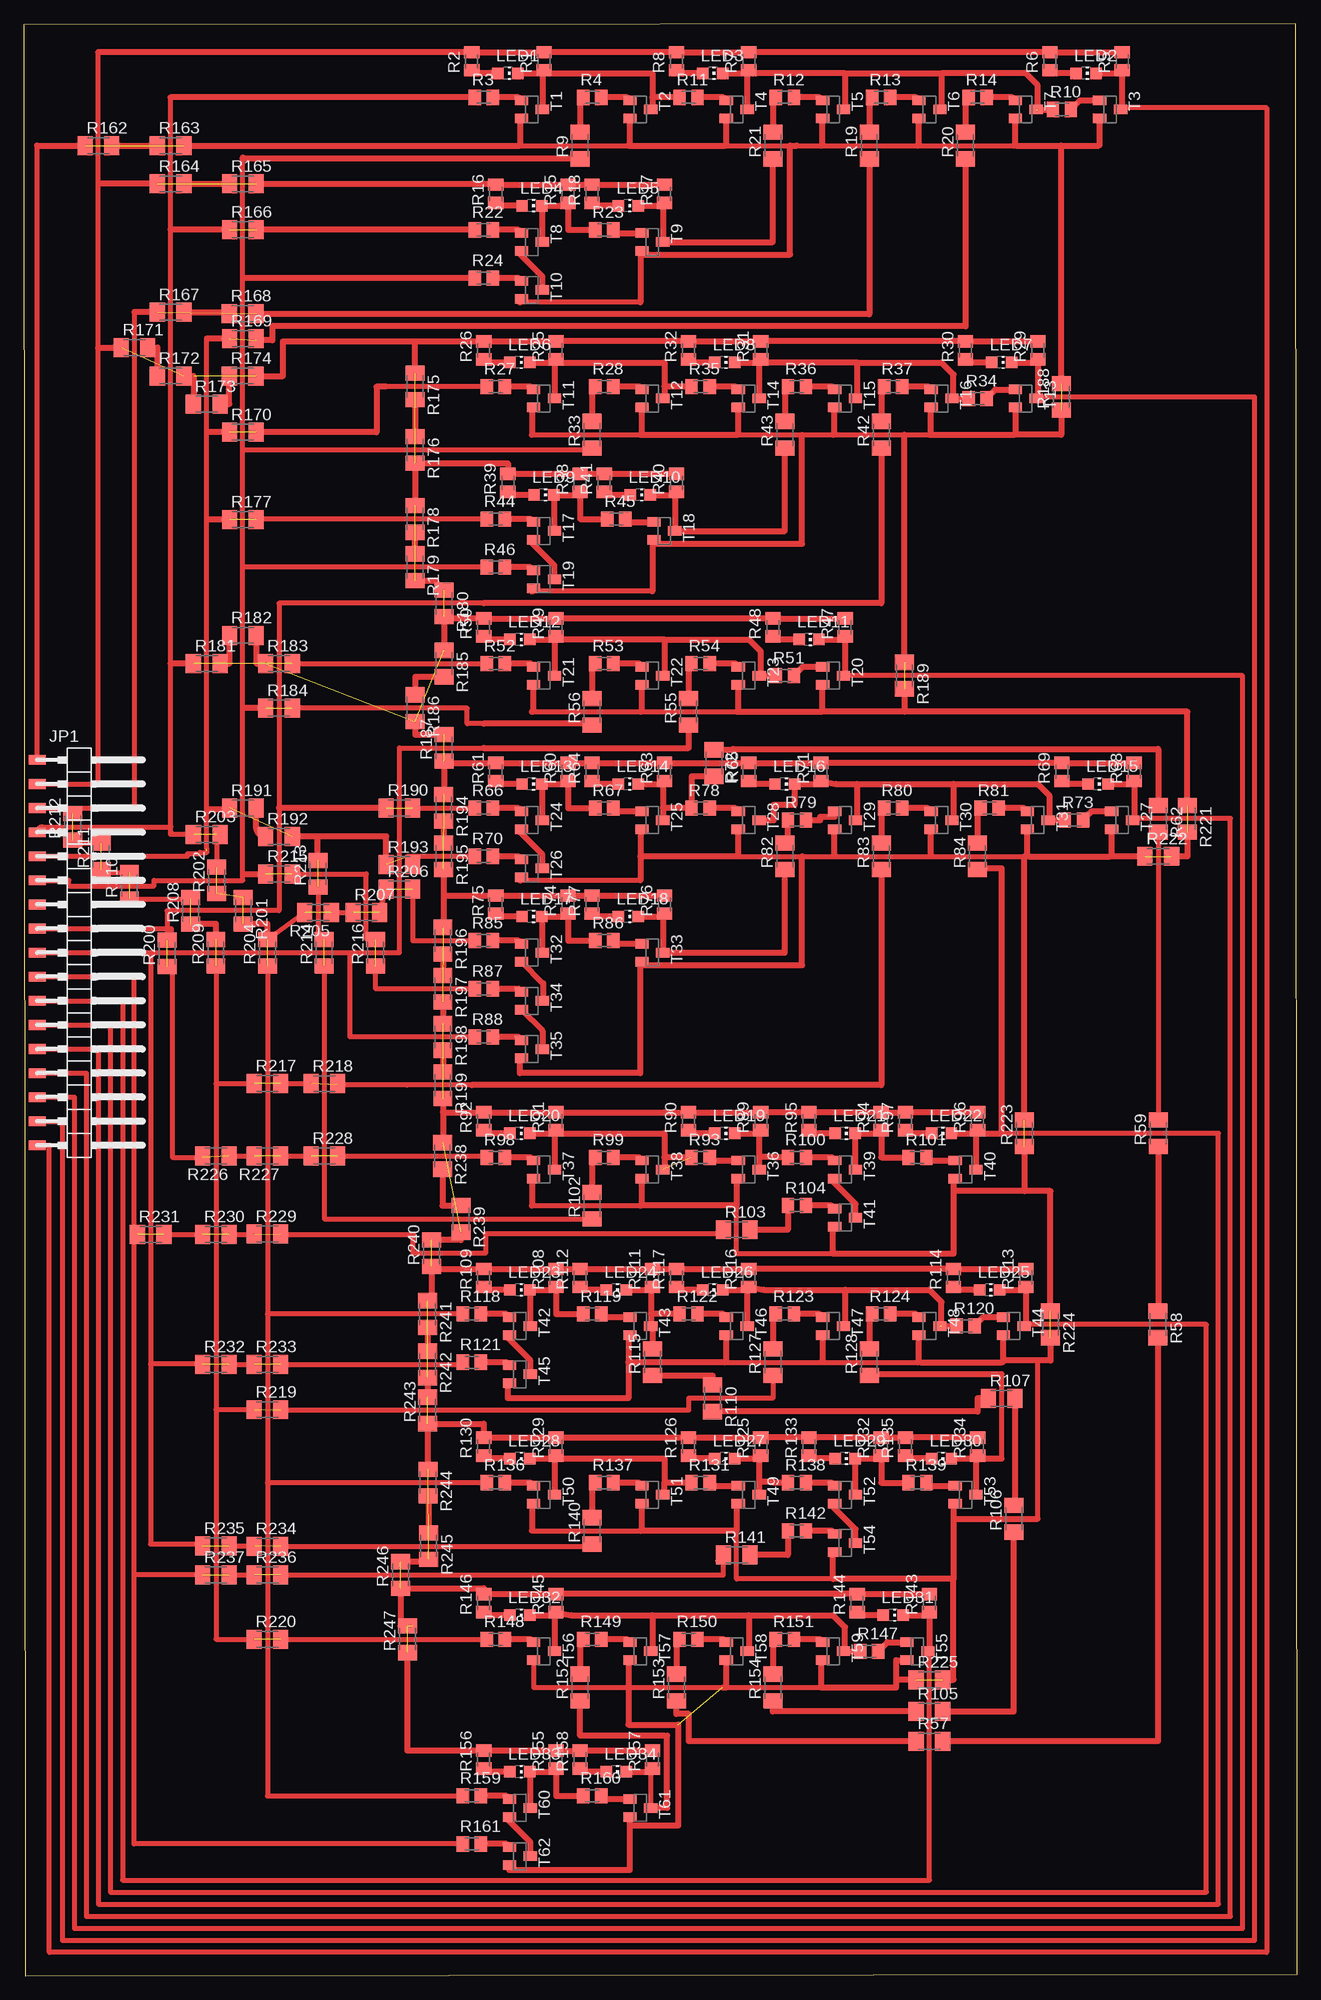
[diagram p2: board, top side]

Size 134.3 x 205.82 mm. Coordinates in mm from the lower left corner, seen from the top.
Outline: 0.15,0 134.3,0.18 134.14,205.82 0,205.69 0.15,0
Copper layers (1*16): Top 0.035mm / dielectric 1.5mm / Bottom 0.035mm
Design rules "default *": minimum track width 20mil, minimum drill 0.35mm, track to track 20mil, track to pad 20mil, pad to pad 20mil, via to via 20mil, smd to smd 6mil, copper to edge 40mil, drill to drill 6mil, minimum pad ring 10mil, minimum via ring 8mil, stop-mask expansion 4mil, vias tented up to drill 0mil, thermal gap 10mil

### Footprints (pad centres in the part's own frame; a part is rotated, then mirrored left to right if it is on the bottom)
1X17SMD/90 = smd 1.016 x 1.778: 1 -1.27,-5.08; 2 1.27,-5.08; 3 3.81,-5.08; 4 6.35,-5.08; 5 8.89,-5.08; 6 11.43,-5.08; 7 13.97,-5.08; 8 16.51,-5.08; 9 19.05,-5.08; 10 21.59,-5.08; 11 24.13,-5.08; 12 26.67,-5.08; 13 29.21,-5.08; 14 31.75,-5.08; 15 34.29,-5.08; 16 36.83,-5.08; 17 39.37,-5.08
CHIP-LED0805 = smd 1.2 x 1.2: A 0,-1.05; C 0,1.05
M0805 = smd 1.3 x 1.6: 1 -0.95,0; 2 0.95,0
M1206 = smd 1.6 x 2: 1 -1.4,0; 2 1.4,0
SOT23 = smd 1 x 1.4: 1 -0.95,-1.1; 2 0.95,-1.1; 3 0,1.1

### Placement (x,y rotation side)
JP1  6.5,126.92 270 top
LED1  51.05,200.58 270 top
LED2  112.01,200.58 270 top
LED3  72.64,200.58 270 top
LED4  53.59,186.61 270 top
LED5  63.75,186.61 270 top
LED6  52.32,170.1 270 top
LED7  103.12,170.1 270 top
LED8  73.91,170.1 270 top
LED9  54.86,156.13 270 top
LED10  65.02,156.13 270 top
LED11  82.8,140.89 270 top
LED12  52.32,140.89 270 top
LED13  53.59,125.65 270 top
LED14  63.75,125.65 270 top
LED15  113.28,125.65 270 top
LED16  80.26,125.65 270 top
LED17  53.59,111.68 270 top
LED18  63.75,111.68 270 top
LED19  73.91,88.82 270 top
LED20  52.32,88.82 270 top
LED21  86.61,88.82 270 top
LED22  96.77,88.82 270 top
LED23  52.32,72.31 270 top
LED24  62.48,72.31 270 top
LED25  101.85,72.31 270 top
LED26  72.64,72.31 270 top
LED27  73.91,54.53 270 top
LED28  52.32,54.53 270 top
LED29  86.61,54.53 270 top
LED30  96.77,54.53 270 top
LED31  91.69,38.02 270 top
LED32  52.32,38.02 270 top
LED33  52.32,21.51 270 top
LED34  62.48,21.51 270 top
R1  54.86,201.85 90 top
R2  47.24,201.85 90 top
R3  48.51,198.04 0 top
R4  59.94,198.04 0 top
R5  115.82,201.85 90 top
R6  108.2,201.85 90 top
R7  76.45,201.85 90 top
R8  68.83,201.85 90 top
R9  58.67,192.96 90 top
R10  109.47,196.77 0 top
R11  70.1,198.04 0 top
R12  80.26,198.04 0 top
R13  90.42,198.04 0 top
R14  100.58,198.04 0 top
R15  57.4,187.88 90 top
R16  49.78,187.88 90 top
R17  67.56,187.88 90 top
R18  59.94,187.88 90 top
R19  89.15,192.96 90 top
R20  99.31,192.96 90 top
R21  78.99,192.96 90 top
R22  48.51,184.07 0 top
R23  61.21,184.07 0 top
R24  48.51,178.99 0 top
R25  56.13,171.37 90 top
R26  48.51,171.37 90 top
R27  49.78,167.56 0 top
R28  61.21,167.56 0 top
R29  106.93,171.37 90 top
R30  99.31,171.37 90 top
R31  77.72,171.37 90 top
R32  70.1,171.37 90 top
R33  59.94,162.48 90 top
R34  100.58,166.29 0 top
R35  71.37,167.56 0 top
R36  81.53,167.56 0 top
R37  91.69,167.56 0 top
R38  58.67,157.4 90 top
R39  51.05,157.4 90 top
R40  68.83,157.4 90 top
R41  61.21,157.4 90 top
R42  90.42,162.48 90 top
R43  80.26,162.48 90 top
R44  49.78,153.59 0 top
R45  62.48,153.59 0 top
R46  49.78,148.51 0 top
R47  86.61,142.16 90 top
R48  78.99,142.16 90 top
R49  56.13,142.16 90 top
R50  48.51,142.16 90 top
R51  80.26,137.08 0 top
R52  49.78,138.35 0 top
R53  61.21,138.35 0 top
R54  71.37,138.35 0 top
R55  70.1,133.27 90 top
R56  59.94,133.27 90 top
R57  95.5,24.74 0 top
R58  119.61,68.68 270 top
R59  119.63,88.82 90 top
R60  57.4,126.92 90 top
R61  49.78,126.92 90 top
R62  119.63,122 270 top
R63  67.56,126.92 90 top
R64  59.94,126.92 90 top
R65  72.8,127.86 270 top
R66  48.51,123.11 0 top
R67  61.21,123.11 0 top
R68  117.09,126.92 90 top
R69  109.47,126.92 90 top
R70  48.51,118.03 0 top
R71  84.07,126.92 90 top
R72  76.45,126.92 90 top
R73  110.74,121.84 0 top
R74  57.4,112.95 90 top
R75  49.78,112.95 90 top
R76  67.56,112.95 90 top
R77  59.94,112.95 90 top
R78  71.37,123.11 0 top
R79  81.53,121.84 0 top
R80  91.69,123.11 0 top
R81  101.85,123.11 0 top
R82  80.26,118.03 90 top
R83  90.42,118.03 90 top
R84  100.58,118.03 90 top
R85  48.51,109.14 0 top
R86  61.21,109.14 0 top
R87  48.51,104.06 0 top
R88  48.51,98.98 0 top
R89  77.72,90.09 90 top
R90  70.1,90.09 90 top
R91  56.13,90.09 90 top
R92  48.51,90.09 90 top
R93  71.37,86.28 0 top
R94  90.42,90.09 90 top
R95  82.8,90.09 90 top
R96  100.58,90.09 90 top
R97  92.96,90.09 90 top
R98  49.78,86.28 0 top
R99  61.21,86.28 0 top
R100  81.53,86.28 0 top
R101  94.23,86.28 0 top
R102  59.94,81.2 90 top
R103  75.18,78.66 0 top
R104  81.53,81.2 0 top
R105  95.5,27.86 0 top
R106  104.39,48.18 90 top
R107  103.12,60.88 0 top
R108  56.13,73.58 90 top
R109  48.51,73.58 90 top
R110  72.64,60.88 270 top
R111  66.29,73.58 90 top
R112  58.67,73.58 90 top
R113  105.66,73.58 90 top
R114  98.04,73.58 90 top
R115  66.29,64.69 90 top
R116  76.45,73.58 90 top
R117  68.83,73.58 90 top
R118  47.24,69.77 0 top
R119  59.94,69.77 0 top
R120  99.31,68.5 0 top
R121  47.24,64.69 0 top
R122  70.1,69.77 0 top
R123  80.26,69.77 0 top
R124  90.42,69.77 0 top
R125  77.72,55.8 90 top
R126  70.1,55.8 90 top
R127  78.99,64.69 90 top
R128  89.15,64.69 90 top
R129  56.13,55.8 90 top
R130  48.51,55.8 90 top
R131  71.37,51.99 0 top
R132  90.42,55.8 90 top
R133  82.8,55.8 90 top
R134  100.58,55.8 90 top
R135  92.96,55.8 90 top
R136  49.78,51.99 0 top
R137  61.21,51.99 0 top
R138  81.53,51.99 0 top
R139  94.23,51.99 0 top
R140  59.94,46.91 90 top
R141  75.18,44.37 0 top
R142  81.53,46.91 0 top
R143  95.5,39.29 90 top
R144  87.88,39.29 90 top
R145  56.13,39.29 90 top
R146  48.51,39.29 90 top
R147  89.15,34.21 0 top
R148  49.78,35.48 0 top
R149  59.94,35.48 0 top
R150  70.1,35.48 0 top
R151  80.26,35.48 0 top
R152  58.67,30.4 90 top
R153  68.83,30.4 90 top
R154  78.99,30.4 90 top
R155  56.13,22.78 90 top
R156  48.51,22.78 90 top
R157  66.29,22.78 90 top
R158  58.67,22.78 90 top
R159  47.24,18.97 0 top
R160  59.94,18.97 0 top
R161  47.24,13.89 0 top
R162  7.87,192.96 0 top
R163  15.49,192.96 0 top
R164  15.49,188.93 0 top
R165  23.11,188.93 0 top
R166  23.11,184.1 0 top
R167  15.49,175.39 0 top
R168  23.09,175.26 0 top
R169  23.11,172.62 0 top
R170  23.11,162.74 0 top
R171  11.68,171.68 0 top
R172  15.49,168.68 0 top
R173  19.3,165.71 0 top
R174  23.09,168.68 0 top
R175  41.27,167.56 270 top
R176  41.27,160.88 270 top
R177  23.11,153.54 0 top
R178  41.25,153.59 270 top
R179  41.25,148.51 270 top
R180  44.35,144.7 270 top
R181  19.3,138.35 0 top
R182  23.11,141.33 0 top
R183  26.92,138.35 0 top
R184  26.92,133.65 0 top
R185  44.32,138.35 270 top
R186  41.27,133.65 270 top
R187  44.32,129.46 90 top
R188  109.4,166.47 90 top
R189  92.89,137.08 270 top
R190  39.62,123.14 0 top
R191  23.11,123.11 0 top
R192  26.92,120.12 0 top
R193  39.62,117.14 0 top
R194  44.3,123.14 270 top
R195  44.3,118.03 270 top
R196  44.2,109.14 270 top
R197  44.2,104.06 270 top
R198  44.2,98.98 270 top
R199  44.2,93.9 270 top
R200  15.11,107.8 90 top
R201  23.16,112.29 270 top
R202  20.35,115.49 90 top
R203  19.3,120.35 0 top
R204  25.7,107.87 90 top
R205  31.04,112.12 180 top
R206  39.62,114.58 0 top
R207  36.12,112.12 0 top
R208  17.63,112.29 90 top
R209  20.27,107.87 90 top
R210  11.15,114.91 90 top
R211  8.18,118.03 90 top
R212  5.16,121.13 90 top
R213  31.04,116.18 90 top
R214  31.7,107.87 90 top
R215  26.92,116.18 0 top
R216  37.11,107.87 90 top
R217  25.7,94.08 0 top
R218  31.7,94.06 0 top
R219  25.7,59.69 0 top
R220  25.7,35.48 0 top
R221  122.71,122 270 top
R222  119.63,118.03 0 top
R223  105.54,88.82 90 top
R224  108.28,68.68 270 top
R225  95.5,31.22 0 top
R226  20.27,86.44 180 top
R227  25.7,86.44 180 top
R228  31.7,86.44 0 top
R229  25.7,78.21 0 top
R230  20.27,78.18 0 top
R231  13.39,78.18 0 top
R232  20.27,64.47 0 top
R233  25.7,64.47 0 top
R234  25.7,45.29 0 top
R235  20.27,45.31 0 top
R236  25.7,42.27 0 top
R237  20.27,42.27 0 top
R238  44.15,86.44 270 top
R239  46.1,79.81 270 top
R240  43,76.17 90 top
R241  42.57,69.77 270 top
R242  42.57,64.47 270 top
R243  42.6,59.61 90 top
R244  42.62,51.99 270 top
R245  42.7,45.31 270 top
R246  39.73,42.27 90 top
R247  40.46,35.48 90 top
T1  53.59,196.77 270 top
T2  65.02,196.77 270 top
T3  114.55,196.77 270 top
T4  75.18,196.77 270 top
T5  85.34,196.77 270 top
T6  95.5,196.77 270 top
T7  105.66,196.77 270 top
T8  53.59,182.8 270 top
T9  66.29,182.8 270 top
T10  53.59,177.72 270 top
T11  54.86,166.29 270 top
T12  66.29,166.29 270 top
T13  105.66,166.29 270 top
T14  76.45,166.29 270 top
T15  86.61,166.29 270 top
T16  96.77,166.29 270 top
T17  54.86,152.32 270 top
T18  67.56,152.32 270 top
T19  54.86,147.24 270 top
T20  85.34,137.08 270 top
T21  54.86,137.08 270 top
T22  66.29,137.08 270 top
T23  76.45,137.08 270 top
T24  53.59,121.84 270 top
T25  66.29,121.84 270 top
T26  53.59,116.76 270 top
T27  115.82,121.84 270 top
T28  76.45,121.84 270 top
T29  86.61,121.84 270 top
T30  96.77,121.84 270 top
T31  106.93,121.84 270 top
T32  53.59,107.87 270 top
T33  66.29,107.87 270 top
T34  53.59,102.79 270 top
T35  53.59,97.71 270 top
T36  76.45,85.01 270 top
T37  54.86,85.01 270 top
T38  66.29,85.01 270 top
T39  86.61,85.01 270 top
T40  99.31,85.01 270 top
T41  86.61,79.93 270 top
T42  52.32,68.5 270 top
T43  65.02,68.5 270 top
T44  104.39,68.5 270 top
T45  52.32,63.42 270 top
T46  75.18,68.5 270 top
T47  85.34,68.5 270 top
T48  95.5,68.5 270 top
T49  76.45,50.72 270 top
T50  54.86,50.72 270 top
T51  66.29,50.72 270 top
T52  86.61,50.72 270 top
T53  99.31,50.72 270 top
T54  86.61,45.64 270 top
T55  94.23,34.21 270 top
T56  54.86,34.21 270 top
T57  65.02,34.21 270 top
T58  75.18,34.21 270 top
T59  85.34,34.21 270 top
T60  52.32,17.7 270 top
T61  65.02,17.7 270 top
T62  52.32,12.62 270 top

### Tracks (layer width: path | path; a pad name or v marks a point on that pad's centre or on a via)
!T  (5 unrouted)
  Top 0.508: JP1.10 11.63,105.33 11.63,78.1 | R161.1 11.63,13.89 11.63,42.27 | 11.63,42.27 11.63,78.1 | 73.2,43.79 arc90 R141.1 73.78,42.27 R236.2 | R103.1 arc-90 73.35,78.23 48.69,78.23 48.69,76.17 41.07,76.17 41.07,78.13 27.1,78.13 R229.2 | R231.1 11.99,78.1 11.63,78.1 | R231.2 R230.1 | R230.2 24.3,78.18 R229.1 | R237.1 11.63,42.27 | R237.2 R236.1
!Y  (5 unrouted)
  Top 0.508: JP1.8 15.57,110.41 15.57,109.27 R200.2 15.11,112.29 26.92,112.29 26.92,123.14 26.92,144.7 48.51,144.7 | R190.2 47.56,123.14 R66.1 | 15.67,106.25 15.69,106.25 15.69,86.47 15.7,86.28 18.87,86.28 R226.2 | R226.1 R227.2 | R227.1 R228.1 | R228.2 48.83,86.44 R98.1
  Top 0.635: R42.1 90.42,144.7 48.51,144.7 | R190.1 26.92,123.14 | R200.1 15.11,106.25 15.69,106.25
!Z  (4 unrouted)
  Top 0.508: JP1.9 13.39,107.87 | 13.39,107.87 34.42,107.87 | 34.42,107.87 39.62,107.87 39.62,129.46 48.51,129.46 | 70.1,130.73 70.1,130.31 | 47.56,99.01 R88.1 34.42,98.98 34.42,107.87 | 13.39,107.87 13.39,64.49 | 13.39,64.49 13.39,45.51 18.87,45.51 R235.1 | 46.29,64.77 R121.1 46.29,64.46 R233.2 | R235.2 24.3,45.31 R234.1 | R234.2 59.94,45.29 R140.1 | R232.1 18.87,64.49 13.39,64.49 | R232.2 R233.1
  Top 0.635: R55.1 70.1,130.73 70.1,129.46 48.51,129.46
A
  Top 0.508: T3.3 115.65,196.94 115.82,196.94 131.06,196.94 131.06,2.46 2.69,2.46 2.69,87.55 JP1.17
  Top 0.635: LED2.C 115.5,200.58 R5.1 115.82,196.94
B
  Top 0.508: JP1.16 4.06,90.09 4.06,3.73 129.79,3.73 129.79,166.46 106.93,166.46
  Top 0.635: LED7.C 106.61,170.1 R29.1 106.93,166.46 T13.3
C
  Top 0.508: JP1.15 5.33,92.63 5.33,5 128.52,5 128.52,137.08 T20.3
  Top 0.635: LED11.C 86.29,140.89 R47.1 86.61,137.25 T20.3
D
  Top 0.508: JP1.14 6.6,95.17 6.6,6.27 127.25,6.27 127.25,122.01 117.09,122.01
  Top 0.635: LED15.C 116.77,125.65 R68.1 117.09,122.01 T27.3
E
  Top 0.508: JP1.13 7.87,97.71 7.87,7.54 125.98,7.54 125.98,88.82 103.12,88.82
  Top 0.635: LED22.C 100.26,88.82 | 100.26,88.82 R96.1 100.41,88.97 T40.3 | 100.26,88.82 103.12,88.82 103.12,116.76 100.58,116.76 R84.1
F
  Top 0.508: JP1.12 9.14,100.25 9.14,8.81 124.71,8.81 124.71,68.67 105.66,68.67
  Top 0.635: LED25.C 105.34,72.31 R113.1 105.66,68.67 T44.3
G
  Top 0.508: JP1.11 10.41,102.79 10.41,10.08 95.5,10.08 95.5,34.38
  Top 0.635: LED31.C 95.18,38.02 R143.1 95.5,34.38 T55.3
G_IN1
  Top 0.635: R57.1 70.14,24.74 70.14,27.61 68.83,27.61 R153.1
G_IN2
  Top 0.635: R105.1 78.99,27.86 R154.1
GND  (9 unrouted)
  Top 0.508: 52.32,192.96 63.75,192.96 | 73.91,192.96 81.53,192.96 84.07,192.96 94.23,192.96 104.39,192.96 | 65.02,176.45 52.32,176.45 | 53.59,162.48 65.02,162.48 | 75.18,162.48 82.09,162.48 85.34,162.48 92.84,162.48 95.5,162.48 | 66.29,145.97 53.59,145.97 | 53.59,133.27 65.02,133.27 75.18,133.27 | 75.18,118.03 82.09,118.03 85.34,118.03 95.5,118.03 105.66,118.03 | 65.02,115.49 52.32,115.49 | 53.59,81.2 65.02,81.2 | 85.34,76.12 75.18,76.12 75.18,81.2 | 73.91,64.69 84.07,64.69 94.23,64.69 | 53.59,46.91 65.02,46.91 | 85.34,41.83 75.18,41.83 75.18,46.91 | 106.93,48.18 106.93,64.86 | T56.2 53.76,30.4 73.69,30.4 84.07,30.4 | JP1.1 1.42,192.96
  Top 0.635: T1.2 arc90 52.32,195.65 52.32,192.96 R163.2 | T2.2 63.92,193.13 arc-90 63.75,192.96 73.91,192.96 arc90 74.08,193.13 T4.2 | 84.07,192.96 arc90 84.24,193.13 T5.2 | 94.23,192.96 arc90 94.4,193.13 T6.2 | 104.39,192.96 arc90 104.56,193.13 | 104.56,193.13 T7.2 | 104.56,193.13 arc90 104.73,192.96 109.4,192.96 | 109.4,192.96 113.28,192.96 arc90 113.45,193.13 T3.2 | T9.2 arc90 65.02,181.68 65.02,181.48 | 65.02,181.48 65.02,176.45 | 52.32,176.45 arc90 52.49,176.62 T10.2 | T11.2 arc90 53.59,165.17 53.59,162.48 | T12.2 65.19,162.65 arc-90 65.02,162.48 75.18,162.48 arc90 75.35,162.65 T14.2 | 85.34,162.48 arc90 85.51,162.65 T15.2 | T16.2 95.67,162.65 arc-90 95.5,162.48 104.39,162.48 | 104.39,162.48 arc90 104.56,162.65 T13.2 | T18.2 arc90 66.29,151.2 66.29,151 | 66.29,151 66.29,145.97 | 53.59,145.97 arc90 53.76,146.14 T19.2 | 53.59,133.27 arc90 53.76,133.44 T21.2 | 65.02,133.27 arc90 65.19,133.44 T22.2 | 75.35,133.44 arc-90 75.18,133.27 arc90 75.35,133.44 | 75.35,133.44 T23.2 | 75.35,133.44 arc90 75.52,133.27 84.07,133.27 | 84.07,133.27 arc90 84.24,133.44 T20.2 | T28.2 75.35,118.2 arc-90 75.18,118.03 65.02,118.03 | 85.34,118.03 arc90 85.51,118.2 T29.2 | 95.5,118.03 arc90 95.67,118.2 T30.2 | 105.83,118.2 arc-90 105.66,118.03 105.54,118.03 R223.2 | 105.83,118.2 T31.2 | 105.83,118.2 arc90 106,118.03 114.55,118.03 arc90 114.72,118.2 | 114.72,118.2 T27.2 | T25.2 arc90 65.02,120.72 65.02,118.03 | 65.02,118.03 65.02,115.49 | 52.32,115.49 arc90 52.49,115.66 T26.2 | T33.2 arc90 65.02,106.75 65.02,106.55 | T35.2 52.49,96.61 arc-90 52.32,96.44 52.32,95.17 65.02,95.17 65.02,106.55 | T40.2 arc90 98.04,83.89 98.04,82.73
  Top 0.635: 98.04,82.73 98.04,76.12 85.34,76.12 85.34,78.66 arc90 85.51,78.83 T41.2 | T37.2 arc90 53.59,83.89 53.59,81.2 | T38.2 65.19,81.37 arc-90 65.02,81.2 75.18,81.2 75.18,84.06 T36.2 arc90 75.18,83.89 | T46.2 74.08,64.86 arc-90 73.91,64.69 63.75,64.69 | T47.2 84.24,64.86 84.07,64.69 | 94.23,64.69 arc90 94.4,64.86 | 94.4,64.86 T48.2 | 94.4,64.86 arc90 94.57,64.69 103.12,64.69 arc90 103.29,64.86 | 103.29,64.86 T44.2 | T43.2 arc90 63.75,67.38 63.75,64.69 | 63.75,64.69 63.75,60.88 51.05,60.88 51.05,62.15 arc90 51.22,62.32 T45.2 | T53.2 arc90 98.04,49.6 98.04,48.18 | 98.04,48.18 98.04,41.83 | 98.04,41.83 85.34,41.83 85.34,44.54 85.51,44.54 T54.2 | T50.2 arc90 53.59,49.6 53.59,46.91 | T51.2 65.19,47.08 arc-90 65.02,46.91 75.18,46.91 75.18,49.77 T49.2 arc90 75.18,49.6 | 51.22,11.52 T62.2 51.22,11.16 63.92,11.16 63.92,15.82 | 98.04,48.18 106.93,48.18 | 103.29,64.86 106.93,64.86 108.28,64.86 R224.2 | 65.02,106.55 82.09,106.55 82.09,118.03 | 66.29,151 82.09,151 82.09,162.48 | 81.53,192.96 80.82,192.96 80.82,181.48 65.02,181.48 | 63.92,15.82 T61.2 | T57.2 63.75,33.26 63.75,26.47 69,26.47 69,17.7 69,15.82 63.92,15.82 | T59.2 arc90 84.07,33.09 84.07,30.4 92,30.4 92,31.22 | 1.42,192.96 R162.1 | R188.2 109.4,192.96 | R188.1 109.4,162.48 104.39,162.48 | R189.1 92.89,162.48 92.84,162.48 | R189.2 92.89,133.27 | 92.89,133.27 84.07,133.27 | R221.1 122.71,133.27 92.89,133.27 | R221.2 122.71,118.03 R222.2 | R222.1 114.72,118.03 114.72,118.2 | R223.1 105.54,82.73 | 105.54,82.73 98.04,82.73 | R224.1 108.28,82.73 105.54,82.73 | 92,31.22 92,33.26 T55.2 | R225.1 92,31.22 | R225.2 98.04,31.22 98.04,41.83 | 73.69,30.4 74.08,30.4 T58.2
N$1
  Top 0.635: LED4.A 50.1,186.61 R16.1
N$2
  Top 0.635: T8.3 54.69,186.56 LED4.C 57.08,186.61 R15.1 57.4,184.07 R23.1
N$3
  Top 0.635: T1.1 52.17,198.04 R3.2
N$4
  Top 0.635: T2.1 63.6,198.04 R4.2
N$5
  Top 0.635: T8.1 52.17,184.07 R22.2
N$6
  Top 0.635: R23.2 62.48,183.75 T9.1
N$7
  Top 0.635: T10.1 52.17,178.99 R24.2
N$8
  Top 0.635: T4.1 73.76,198.04 R11.2
N$9
  Top 0.635: R10.2 111.37,197.72 T3.1
N$10
  Top 0.635: T5.1 83.92,198.04 R12.2
N$11
  Top 0.635: T6.1 94.08,198.04 R13.2
N$12
  Top 0.635: T7.1 104.24,198.04 R14.2
N$13
  Top 0.635: LED1.A 47.56,200.58 R2.1
N$14
  Top 0.635: LED1.C 54.54,200.58 R1.1 | R1.1 54.69,200.73 T1.3 | R1.1 55.18,200.58 66.29,200.58 66.29,198.04 | 66.29,198.04 66.29,196.94 T2.3 | R11.1 66.29,198.04
N$15
  Top 0.635: R4.1 arc90 58.67,197.72 R9.2
N$16
  Top 0.635: R104.1 80.58,78.66 R103.2
N$17
  Top 0.635: LED3.A 69.15,200.58 R8.1
N$18  (1 unrouted)
  Top 0.635: LED3.C 76.13,200.58 R7.1 76.28,200.73 76.28,200.58 | 76.28,200.58 T4.3 | 86.61,200.58 86.61,196.94 T5.3 | 86.61,200.58 96.77,200.58 | 96.77,200.58 96.77,196.94 T6.3 | 96.77,200.58 105.66,200.58 106.93,199.31 106.93,196.94 T7.3 | 106.93,196.77 R10.1 | 86.61,200.58 76.28,200.58
N$19
  Top 0.635: LED5.A 60.26,186.61 R18.1
N$20
  Top 0.635: LED5.C 67.24,186.61 R17.1 67.39,186.76 T9.3 78.99,182.8 R21.1
N$21
  Top 0.635: LED2.A 108.52,200.58 R6.1
N$22
  Top 0.635: R142.1 80.58,44.37 R141.2
N$23
  Top 0.635: T10.3 54.69,179.16 52.32,181.53 52.32,181.68 T8.2
N$24
  Top 0.635: R12.1 arc90 78.99,197.72 R21.2
N$25
  Top 0.635: R107.2 104.52,49.58 R106.2
N$26
  Top 0.635: R115.1 72.64,63.29 R110.1
N$27
  Top 0.635: T11.1 53.44,167.56 R27.2
N$28
  Top 0.635: T12.1 64.87,167.56 R28.2
N$29
  Top 0.635: R13.1 arc90 89.15,197.72 R19.2
N$30
  Top 0.635: R14.1 arc90 99.31,197.72 R20.2
N$31
  Top 0.635: T17.1 53.44,153.59 R44.2
N$32
  Top 0.635: R45.2 63.75,153.27 T18.1
N$33
  Top 0.635: T19.1 53.44,148.51 R46.2
N$34
  Top 0.635: T14.1 75.03,167.56 R35.2
N$35
  Top 0.635: R34.2 102.48,167.24 T13.1
N$36
  Top 0.635: T15.1 85.19,167.56 R36.2
N$37
  Top 0.635: T16.1 95.35,167.56 R37.2
N$38
  Top 0.635: R105.2 104.39,27.86 R106.1
N$39
  Top 0.635: LED6.A 48.83,170.1 R26.1
N$40
  Top 0.635: LED6.C 55.81,170.1 R25.1 | R25.1 55.96,170.25 T11.3 | R25.1 56.45,170.1 67.56,170.1 67.56,167.56 | 67.56,167.56 67.56,166.46 T12.3 | R35.1 67.56,167.56
N$41
  Top 0.635: R28.1 arc90 59.94,167.24 R33.2
N$42
  Top 0.635: R110.2 100.58,59.48 100.58,60.88 R107.1
N$43
  Top 0.635: LED9.A 51.37,156.13 R39.1
N$44
  Top 0.635: T17.3 55.96,156.08 LED9.C 58.35,156.13 R38.1 58.67,153.59 R45.1
N$45
  Top 0.635: LED8.A 70.42,170.1 R32.1
N$46
  Top 0.152: T16.3 98.04,166.29
  Top 0.635: LED8.C 77.4,170.1 | 77.4,170.1 R31.1 77.55,170.25 T14.3 | 87.88,170.1 87.88,166.46 T15.3 | 87.88,170.1 96.77,170.1 98.04,168.83 98.04,166.46 T16.3 | 98.04,166.29 R34.1 | 87.88,170.1 77.4,170.1
N$47
  Top 0.635: LED10.A 61.53,156.13 R41.1
N$48
  Top 0.635: LED10.C 68.51,156.13 R40.1 68.66,156.28 T18.3 80.26,152.32 R43.1
N$49
  Top 0.635: LED7.A 99.63,170.1 R30.1
N$50
  Top 0.635: R65.1 74.83,129.26 74.83,129.35 119.63,129.35 R62.1
N$51
  Top 0.635: T19.3 55.96,148.68 53.59,151.05 53.59,151.2 T17.2
N$52
  Top 0.508: R62.2 R59.2
N$53
  Top 0.635: R59.1 119.63,70.08 R58.1
N$54
  Top 0.635: R37.1 arc90 90.42,167.24 R42.2
N$55
  Top 0.635: R58.2 119.61,24.74 R57.2
N$56
  Top 0.635: R36.1 arc90 80.26,167.24 R43.2
N$57
  Top 0.635: T21.1 53.44,138.35 R52.2
N$58
  Top 0.635: R51.2 82.16,138.03 T20.1
N$59
  Top 0.635: T22.1 64.87,138.35 R53.2
N$60
  Top 0.635: T23.1 75.03,138.35 R54.2
N$61
  Top 0.635: T28.1 75.03,123.11 R78.2
N$62
  Top 0.635: R73.2 112.64,122.79 T27.1
N$63
  Top 0.635: LED12.A 48.83,140.89 R50.1
N$64
  Top 0.152: 77.72,137.25 77.72,137.08
  Top 0.635: LED12.C 55.81,140.89 55.96,141.04 | R49.1 55.96,141.04 | 55.96,141.04 T21.3 | 67.56,140.89 67.56,137.25 T22.3 | 67.56,140.89 76.45,140.89 77.72,139.62 77.72,137.25 T23.3 | 77.72,137.08 R51.1 | 55.96,141.04 56.11,140.89 67.56,140.89
N$65
  Top 0.635: R79.2 83.99,121.84 83.99,122.22 85.51,122.22 T29.1
N$66
  Top 0.635: LED11.A 79.31,140.89 R48.1
N$67
  Top 0.635: R162.2 R163.1
N$68
  Top 0.635: R54.1 arc90 70.1,138.03 R55.2
N$69
  Top 0.635: T30.1 95.35,123.11 R80.2
N$70
  Top 0.635: R53.1 arc90 59.94,138.03 R56.2
N$71
  Top 0.635: T31.1 105.51,123.11 R81.2
N$72
  Top 0.635: R164.2 R165.1
N$73
  Top 0.635: LED16.A 76.77,125.65 R72.1
N$74
  Top 0.635: R71.1 83.75,125.65 LED16.C 81.31,123.47 79.11,123.47 79.11,121.84 T28.3 | R71.1 83.9,125.8 | R71.1 85.66,125.65 87.88,125.65 | 87.88,125.65 87.88,122.01 T29.3 | 87.88,125.65 98.04,125.65 | 98.04,125.65 98.04,122.01 T30.3 | 98.04,125.65 106.93,125.65 108.2,124.38 108.2,121.84 | 108.2,121.84 R73.1 | T31.3 108.2,121.84
N$75
  Top 0.635: T32.1 52.17,109.14 R85.2
N$76
  Top 0.635: LED15.A 109.79,125.65 R69.1
N$77
  Top 0.635: R167.2 21.69,175.39 R168.1
N$78
  Top 0.635: R80.1 arc90 90.42,122.79 R83.2
N$79
  Top 0.635: R81.1 arc90 100.58,122.79 R84.2
N$80
  Top 0.635: R82.2 80.58,119.43 R79.1
N$81
  Top 0.635: T34.2 54.69,99.64 T35.3
N$82
  Top 0.635: R67.2 62.48,122.79 T25.1
N$83
  Top 0.635: T26.1 52.17,118.03 R70.2
N$84
  Top 0.635: LED13.A 50.1,125.65 R61.1
N$85
  Top 0.635: T24.3 54.69,125.6 LED13.C 57.08,125.65 R60.1 57.4,123.11 R67.1
N$86
  Top 0.635: LED14.A 60.26,125.65 R64.1
N$87
  Top 0.635: R86.2 62.48,108.82 T33.1
N$88
  Top 0.635: T26.3 54.69,118.2 52.32,120.57 52.32,120.72 T24.2
N$89
  Top 0.635: T46.1 73.76,69.77 R122.2
N$90
  Top 0.635: R171.2 14.09,171.68 R172.1
N$91
  Top 0.635: T34.1 52.17,104.06 R87.2
N$92
  Top 0.635: LED17.A 50.1,111.68 R75.1
N$93
  Top 0.635: T47.1 83.92,69.77 R123.2
N$94
  Top 0.635: LED18.A 60.26,111.68 R77.1
N$95
  Top 0.635: 54.86,102.96 54.78,102.88 | 54.78,102.88 T34.3 | T32.2 54.78,104.64 54.78,102.88
N$96
  Top 0.635: T60.1 50.9,18.97 R159.2
N$97
  Top 0.635: R173.2 21.69,165.71 R174.1
N$98
  Top 0.635: LED18.C 67.24,111.68 R76.1 67.39,111.83 T33.3 80.26,107.87 R82.1
N$99
  Top 0.635: T35.1 52.17,98.98 R88.2
N$100
  Top 0.635: LED26.A 69.15,72.31 R117.1
N$101
  Top 0.635: T37.1 53.44,86.28 R98.2
N$102
  Top 0.635: T38.1 64.87,86.28 R99.2
N$103
  Top 0.635: LED20.A 48.83,88.82 R92.1
N$104  (1 unrouted)
  Top 0.635: LED20.C 55.81,88.82 R91.1 | R91.1 55.96,88.97 T37.3 | R91.1 56.45,88.82 67.56,88.82 67.56,86.28 | 67.56,86.28 67.56,85.18 T38.3 | R93.1 67.56,86.28
N$105  (1 unrouted)
  Top 0.635: LED26.C 76.13,72.31 R116.1 | R116.1 76.28,72.46 T46.3 | R116.1 78.04,72.31 86.61,72.31 | 86.61,72.31 86.61,68.67 T47.3 | 86.61,72.31 95.5,72.31 96.77,71.04 96.77,68.5 R120.1
N$106
  Top 0.635: LED25.A 98.36,72.31 R114.1
N$107
  Top 0.635: R93.2 72.64,85.96 T36.1
N$108
  Top 0.635: T39.1 85.19,86.28 R100.2
N$109
  Top 0.635: LED19.A 70.42,88.82 R90.1
N$110
  Top 0.635: R175.2 R176.1
N$111
  Top 0.635: R101.2 95.5,85.96 T40.1
N$112
  Top 0.635: R179.1 R178.2
N$113
  Top 0.635: R181.2 21.71,138.35 R182.1
N$114
  Top 0.635: R124.1 arc90 89.15,69.45 R128.2
N$115
  Top 0.635: R123.1 arc90 78.99,69.45 R127.2
N$116
  Top 0.635: R185.2 41.28,136.95 R186.1
N$117
  Top 0.635: R192.1 arc-90 24.51,121.13 R191.2
N$118
  Top 0.635: T45.1 50.9,64.69 R121.2
N$119
  Top 0.635: T32.3 54.69,111.63 LED17.C 57.08,111.68 R74.1 57.4,109.14 R86.1
N$120
  Top 0.635: R194.2 R195.1
N$121
  Top 0.635: LED23.A 48.83,72.31 R109.1
N$122
  Top 0.635: R196.2 R197.1
N$123
  Top 0.635: R198.2 R199.1
N$124
  Top 0.635: R238.2 44.15,81.21 R239.1
N$125
  Top 0.635: T45.3 53.42,64.86 51.05,67.23 51.05,67.38 T42.2
N$126
  Top 0.635: R241.2 R242.1
N$127
  Top 0.635: T41.1 85.19,81.2 R104.2
N$128
  Top 0.635: R244.2 42.7,50.59 R245.1
N$129
  Top 0.635: T39.3 87.71,88.77 LED21.C 90.1,88.82 R94.1 90.42,86.28 R101.1
N$132
  Top 0.635: T50.1 53.44,51.99 R136.2
N$139
  Top 0.635: R99.1 arc90 59.94,85.96 R102.2
N$141
  Top 0.635: R131.2 72.64,51.67 T49.1
N$143
  Top 0.635: T52.1 85.19,51.99 R138.2
N$144
  Top 0.635: LED19.C 77.4,88.82 R89.1 77.55,88.97 77.55,86.34 | 77.55,86.34 T36.3 | R100.1 79.08,86.28 79.08,86.34 77.55,86.34
N$145
  Top 0.635: T41.3 87.71,81.37 85.34,83.74 85.34,83.89 T39.2
N$147
  Top 0.635: LED21.A 83.12,88.82 R95.1
N$148
  Top 0.635: R139.2 95.5,51.67 T53.1
N$151
  Top 0.635: T52.3 87.71,54.48 LED29.C 90.1,54.53 R132.1 90.42,51.99 R139.1
N$152
  Top 0.635: T54.3 87.71,47.08 85.34,49.45 85.34,49.6 T52.2
N$153
  Top 0.635: LED27.C 77.4,54.53 R125.1 77.55,54.68 77.55,52.05 | 77.55,52.05 T49.3 | R138.1 79.08,51.99 79.08,52.05 77.55,52.05
N$157
  Top 0.635: R147.2 91.05,35.16 T55.1
N$158
  Top 0.635: T57.1 63.6,35.48 R149.2
N$159
  Top 0.635: T58.1 73.76,35.48 R150.2
N$160
  Top 0.635: T59.1 83.92,35.48 R151.2
N$162
  Top 0.635: R150.1 arc90 68.83,35.16 R153.2
N$164
  Top 0.635: R149.1 arc90 58.67,35.16 R152.2
N$166
  Top 0.635: R151.1 arc90 78.99,35.16 R154.2
N$168
  Top 0.635: R160.2 61.21,18.65 T61.1
N$169
  Top 0.635: T62.1 50.9,13.89 R161.2
N$173
  Top 0.635: T62.3 53.42,14.06 51.05,16.43 51.05,16.58 T60.2
N$200
  Top 0.635: T24.1 52.17,123.11 R66.2
N$251
  Top 0.635: LED28.A 48.83,54.53 R130.1
N$252
  Top 0.152: T51.3 67.56,50.89
  Top 0.635: LED28.C 55.81,54.53 R129.1 | R129.1 55.96,54.68 T50.3 | R129.1 56.45,54.53 67.56,54.53 67.56,51.99 | 67.56,50.89 67.56,51.99 | R131.1 67.56,51.99
N$253
  Top 0.635: LED27.A 70.42,54.53 R126.1
N$254
  Top 0.635: LED29.A 83.12,54.53 R133.1
N$255
  Top 0.508: 103.12,54.53 103.12,63.42
  Top 0.635: R128.1 89.15,63.42 103.12,63.42 | LED30.C 100.26,54.53 | 100.26,54.53 R134.1 100.41,54.68 T53.3 | 100.26,54.53 103.12,54.53
N$256
  Top 0.635: LED32.A 48.83,38.02 R146.1
N$257
  Top 0.635: LED32.C 55.81,38.02 R145.1 | R145.1 55.96,38.17 T56.3 | R145.1 57.72,38.02 66.29,38.02 | 66.29,38.02 66.29,34.38 T57.3 | 66.29,38.02 76.45,38.02 | 76.45,38.02 76.45,34.38 T58.3 | 76.45,38.02 85.34,38.02 86.61,36.75 86.61,34.21 | 86.61,34.21 R147.1 | T59.3 86.61,34.21
N$258
  Top 0.635: LED31.A 88.2,38.02 R144.1
N$260
  Top 0.635: LED33.A 48.83,21.51 R156.1
N$261
  Top 0.635: T60.3 53.42,21.46 LED33.C 55.81,21.51 R155.1 56.13,18.97 R160.1
N$262
  Top 0.508: T61.3 66.12,21.51 66.12,21.66 | 67.86,25.32 67.56,25.32
  Top 0.635: 66.12,21.66 R157.1 | LED34.C 66.12,21.51 | T61.3 67.86,17.7 67.86,25.32 | 67.56,25.32 58.67,25.32 R152.1
N$263
  Top 0.635: R120.2 101.21,69.45 T44.1
N$264
  Top 0.635: T42.1 50.9,69.77 R118.2
N$265
  Top 0.635: T48.1 94.08,69.77 R124.2
N$266
  Top 0.635: T42.3 53.42,72.26 LED23.C 55.81,72.31 R108.1 56.13,69.77 R119.1
N$267
  Top 0.635: R119.2 61.21,69.45 T43.1
N$269
  Top 0.635: T56.1 53.44,35.48 R148.2
N$271
  Top 0.635: R137.1 arc90 59.94,51.67 R140.2
N$272
  Top 0.635: T51.1 64.87,51.99 R137.2
N$274
  Top 0.635: T54.1 85.19,46.91 R142.2
S$2
  Top 0.635: LED22.A 93.28,88.82 R97.1
S$4
  Top 0.635: LED24.A 58.99,72.31 R112.1
S$5
  Top 0.635: LED34.A 58.99,21.51 R158.1
S$40
  Top 0.635: LED30.A 93.28,54.53 R135.1
S$123
  Top 0.635: LED24.C 65.97,72.31 R111.1 66.12,72.46 66.12,69.77 | 66.12,69.77 T43.3 66.29,68.5 R115.2 | R122.1 66.12,69.77
S$124
  Top 0.635: LED14.C 67.24,125.65 R63.1 67.39,125.8 67.39,123.11 | 67.39,123.11 T25.3 | 67.39,123.11 R78.1 70.42,126.46 R65.2
T  (3 unrouted)
  Top 0.508: JP1.6 4.75,115.49 4.75,115.04 arc90 4.88,114.91 13.74,114.91 13.74,115.49 23.11,115.49 23.11,116.15 23.11,133.65 23.11,148.62 | 23.11,148.62 23.11,160.88 | 23.11,160.88 23.11,178.94 23.11,191.69 | 23.11,160.88 59.94,160.88 R33.1 | R46.1 23.22,148.51 23.11,148.62 | 48.51,132 46.76,132 46.76,133.65 R184.2 | 28.7,116.18 36.14,116.18 arc90 36.12,116.15 36.12,109.32 37.06,109.32 arc-90 R216.2 | R87.1 37.11,104.06 R216.1
  Top 0.635: R56.1 59.94,132 48.51,132 | R9.1 23.11,191.56 23.11,191.69 | R24.1 23.11,178.99 23.11,178.94 | R184.1 23.11,133.65 | 23.11,116.15 25.52,116.15 R215.1 | R215.2 28.7,116.18
VCC  (20 unrouted)
  Top 0.508: JP1.2 7.87,125.65 7.87,171.58 7.87,188.92 7.87,202.84
  Top 0.635: R5.2 R6.2 R7.2 R8.2 R1.2 R2.2 7.87,202.8 7.87,202.84 | R17.2 R18.2 R15.2 R16.2 49.78,188.92 R165.2 | R29.2 R30.2 R31.2 R32.2 R25.2 R26.2 41.28,172.32 | R40.2 R41.2 R38.2 R39.2 51.05,159.48 R176.2 41.28,154.99 R178.1 | R47.2 R48.2 R49.2 R50.2 44.54,143.11 R180.2 44.32,143.3 R185.1 | R68.2 R69.2 R71.2 R72.2 R63.2 R64.2 R60.2 R61.2 44.32,127.87 R187.1 44.32,124.54 R194.1 | R76.2 R77.2 R74.2 R75.2 49.78,113.87 44.3,113.87 | R90.2 R89.2 R95.2 R94.2 R97.2 R96.2 | 67.56,91.04 R90.2 | R90.2 R91.2 R92.2 44.2,91.04 | R113.2 R114.2 R116.2 R117.2 R111.2 R112.2 R108.2 R109.2 43,74.53 R240.1 43,71.17 R241.1 | R126.2 R125.2 R133.2 R132.2 R135.2 R134.2 | 67.56,56.75 R126.2 | R126.2 R129.2 R130.2 48.51,58.21 R243.1 42.6,53.39 R244.1 | R143.2 R144.2 R145.2 R146.2 48.51,40.87 R246.1 39.73,36.88 41,36.88 | R157.2 R158.2 R155.2 R156.2 40.46,23.73 R247.1 | R164.1 7.87,188.92 | 7.87,171.58 7.87,171.68 R171.1 | R172.2 17.9,168.68 R173.1 | R174.2 27.36,168.68 27.36,172.32 41.28,172.32 | R175.1 41.28,172.32 | R179.2 43.34,147.11 R180.1 | R182.2 24.51,138.35 R183.1 | R186.2 41.28,130.86 R187.2 | R195.2 44.3,113.87 | 44.3,113.87 44.3,110.54 R196.1 | R197.2 R198.1 | R199.2 44.2,91.04 | 44.2,91.04 44.2,87.84 R238.1 | R239.2 46.1,77.57 R240.2 | R242.2 42.57,61.01 R243.2 | R245.2 42.7,43.67 R246.2
X  (10 unrouted)
  Top 0.508: JP1.3 5.31,123.11 | 5.31,123.11 11.68,123.11 11.68,175.41 | R127.1 78.99,60.88 70.1,60.88 70.1,59.61 27.1,59.61 R219.2 | R212.2 5.31,122.53 5.31,123.11 | R212.1 5.16,119.43 R211.2 | R211.1 8.18,116.31 R210.2 | R210.1 17.63,113.51 R208.2 | R209.1 20.27,94.03 | 20.27,94.03 20.27,59.69 | 20.27,59.69 20.27,35.48 R220.1 | 47.24,93.9 40.39,93.9 | 40.39,93.9 40.39,93.88 | R217.2 30.3,94.08 R218.1 | 40.39,93.9 33.1,93.9 R218.2 | R217.1 24.3,94.03 20.27,94.03 | R219.1 20.27,59.69 | R220.2 R148.1
  Top 0.635: R19.1 89.15,175.18 24.49,175.18 R168.2 | R83.1 90.42,93.9 47.24,93.9 | R167.1 11.68,175.39 11.68,175.41 | R209.2 20.27,110.89 R208.1
Y  (10 unrouted)
  Top 0.508: 15.52,121.13 15.52,120.62 15.49,120.34 R203.1 | 15.52,121.13 15.49,138.35 15.49,184.1 15.49,198.04 | R183.2 R52.1 | R203.2 20.35,120.34 R202.2 | JP1.4 arc-90 1.98,121.13 15.52,121.13 | R205.2 R204.2 | R205.1 R207.1 | R207.2 R206.1 | R206.2 41.02,109.14 R85.1 | R204.1 25.7,69.77 | 25.7,69.77 25.7,51.99 | 25.7,51.99 25.7,18.97 R159.1 | R118.1 25.7,69.77 | R136.1 25.7,51.99
  Top 0.635: R3.1 15.49,198.04 | R22.1 24.51,184.07 R166.2 | R166.1 15.49,184.1 | R181.1 15.49,138.35 | R204.2 25.7,110.89 R201.2
Z  (8 unrouted)
  Top 0.508: JP1.5 17.27,118.03 17.27,118.31 18.58,118.31 18.58,118.46 19.3,118.46 19.3,118.58 | 19.3,118.82 19.3,122.99 19.3,153.59 19.3,162.76 19.3,172.49 | R27.1 38.2,167.56 | R44.1 24.56,153.59 R177.2 | R70.1 40.51,118.03 arc-90 41.02,117.52 R193.2 | R213.1 31.04,109.27 R214.2 | R214.1 31.7,79.8 R102.1
  Top 0.635: R20.1 99.31,173.91 26.21,173.91 26.21,172.44 24.51,172.44 R169.2 | R169.1 19.3,172.62 19.3,172.49 | 38.2,167.56 37.39,167.56 37.39,167.54 37.21,167.54 37.21,162.74 R170.2 | R170.1 19.3,162.74 19.3,162.76 | R177.1 19.35,153.54 19.3,153.59 | R191.1 arc-90 21.59,122.99 19.3,122.99 | R193.1 38.22,120.12 31.01,120.12 | 31.01,120.12 R192.2 | R213.2 31.01,117.58 31.01,120.12